# EAGLE design FalangeNANO (EAGLE 7.6.0)
CNAME: OffGrid-Devices Falange; CREVISION: B; DESIGNER: Tiago Angelo
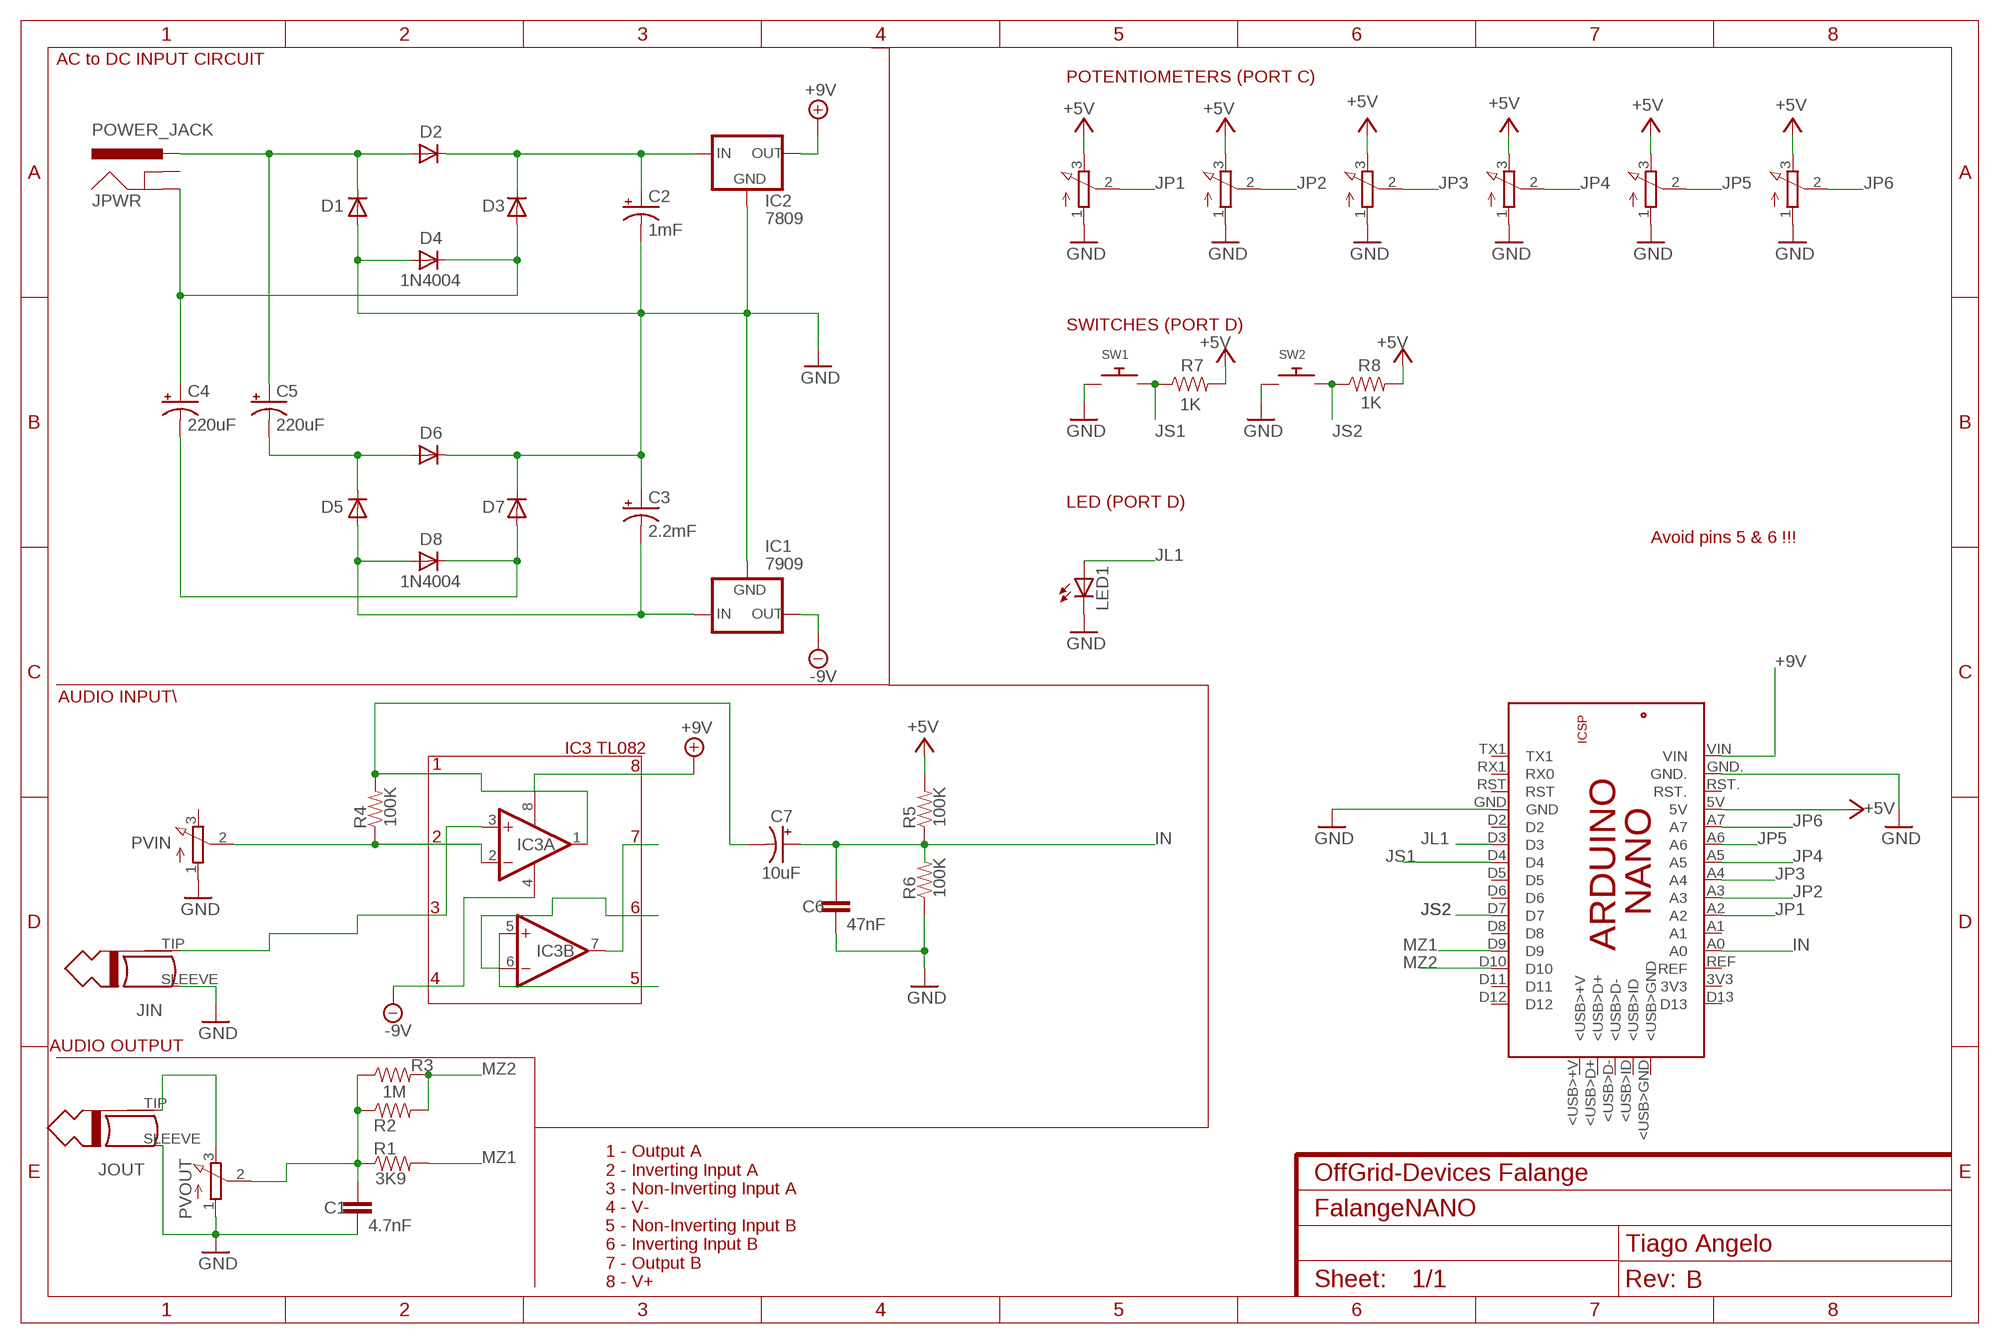
[diagram p0: schematic, sheet 1]

## Parts
C1  4.7nF  C-EU050-025X075  [C050-025X075]
C2  1mF  CPOL-USE30-16AXIAL  [E30-16]
C3  2.2mF  CPOL-USE35-16AXIAL  [E35-16]
C4  220uF  CPOL-USE5-10.5  [E5-10,5]
C5  220uF  CPOL-USE5-10.5  [E5-10,5]
C6  47nF  C-EU050-025X075  [C050-025X075]
C7  10uF  CPOL-USE2.5-6  [E2,5-6]
D1  1N4004  [DO41-10]
D2  1N4004  [DO41-10]
D3  1N4004  [DO41-10]
D4  1N4004  [DO41-10]
D5  1N4004  [DO41-10]
D6  1N4004  [DO41-10]
D7  1N4004  [DO41-10]
D8  1N4004  [DO41-10]
IC1  7909  79XXL  [79XXL]
IC2  7809  78XXL  [78XXL]
IC3  TL082P  [DIL08]
JIN  MONO_PLUG  [TWO_PADS]
JOUT  MONO_PLUG  [TWO_PADS]
JPWR  POWER_JACK  [POWER_JACK_PTH]
LED1  LED3MM  [LED3MM]
P1  3RP/1610N  [3RP/1610N]
P2  3RP/1610N  [3RP/1610N]
P3  3RP/1610N  [3RP/1610N]
P4  3RP/1610N  [3RP/1610N]
P5  3RP/1610N  [3RP/1610N]
P6  3RP/1610N  [3RP/1610N]
PCB1  ARDUINO_NANO  [ARDUINO_NANO]
PVIN  3RP/1610N  [3RP/1610N]
PVOUT  3RP/1610N  [3RP/1610N]
R1  3K9  1KOHM-HORIZ-1/4W-5%  [AXIAL-0.3]
R2  1M  1KOHM-HORIZ-1/4W-5%  [AXIAL-0.3]
R3  1M  1KOHM-HORIZ-1/4W-5%  [AXIAL-0.3]
R4  100K  1KOHM-HORIZ-1/4W-5%  [AXIAL-0.3]
R5  100K  1KOHM-HORIZ-1/4W-5%  [AXIAL-0.3]
R6  100K  1KOHM-HORIZ-1/4W-5%  [AXIAL-0.3]
R7  1K  1KOHM-HORIZ-1/4W-5%  [AXIAL-0.3]
R8  1K  1KOHM-HORIZ-1/4W-5%  [AXIAL-0.3]
SW1  SWITCH_PUSHBUTTONEVQ-PE  [TACT_PANA-EVQ]
SW2  SWITCH_PUSHBUTTONEVQ-PE  [TACT_PANA-EVQ]

## Nets
+5V: P1.3(E) P2.3(E) P3.3(E) P4.3(E) P5.3(E) P6.3(E) PCB1.5V R5.P$2 R7.P$2 R8.P$2
+9V: IC2.OUT IC3.8(P:V+) PCB1.VIN
-9V: IC1.OUT IC3.4(P:V-)
GND: C1.2 C2.- C3.+ C6.2 D1.A D4.A D6.C D7.C IC1.GND IC2.GND JIN.SLEEVE JOUT.SLEEVE LED1.K(C) P1.1(A) P2.1(A) P3.1(A) P4.1(A) P5.1(A) P6.1(A) PCB1.GND PCB1.GND. PVIN.1(A) PVOUT.1(A) R6.P$1 SW1.P$1 SW2.P$1
IN: C6.1 C7.+ PCB1.A0 R5.P$1 R6.P$2
JL1: LED1.A PCB1.D3
JP1: P1.2(S) PCB1.A2
JP2: P2.2(S) PCB1.A3
JP3: P3.2(S) PCB1.A4
JP4: P4.2(S) PCB1.A5
JP5: P5.2(S) PCB1.A6
JP6: P6.2(S) PCB1.A7
JP8-2: C1.1 PVOUT.2(S) R1.P$1 R2.P$1 R3.P$1
JP8-3: JOUT.TIP PVOUT.3(E)
JS1: PCB1.D4 R7.P$1 SW1.P$2
JS2: PCB1.D7 R8.P$1 SW2.P$2
MZ1: PCB1.D9 R1.P$2
MZ2: PCB1.D10 R2.P$2 R3.P$2
N$2: C5.- D5.C D6.A
N$4: C4.- D7.A D8.C
N$5: C2.+ D2.C D3.C IC2.IN
N$7: C3.- D5.A D8.A IC1.IN
N$8: C7.- IC3.1(A:OUT) R4.P$2
N$9: IC3.2(A:-IN) PVIN.2(S) R4.P$1
N$12: IC3.7(B:OUT)
N$13: IC3.6(B:-IN)
N$14: IC3.5(B:+IN)
N$15: IC3.3(A:+IN) JIN.TIP
PWRSLV: C4.+ D3.A D4.C JPWR.GND
PWRTIP: C5.+ D1.C D2.A JPWR.PWR
Unconnected: JPWR.GNDBREAK PCB1.3V3 PCB1.5V. PCB1.<USB>+V PCB1.<USB>D+ PCB1.<USB>D- PCB1.<USB>GND PCB1.<USB>ID PCB1.A1 PCB1.D2 PCB1.D5 PCB1.D6 PCB1.D8 PCB1.D11 PCB1.D12 PCB1.D13 PCB1.GND_ PCB1.MISO PCB1.MOSI PCB1.REF PCB1.RESET.. PCB1.RST PCB1.RST. PCB1.RX1(RX0) PCB1.SCK PCB1.TX1 PVIN.3(E)

## Notes on the sheet
- AC to DC INPUT CIRCUIT
- POTENTIOMETERS (PORT C)
- SWITCHES (PORT D)
- LED (PORT D)
- Avoid pins 5 & 6 !!!
- AUDIO INPUT\
- IC3 TL082
- 1 | 8
- 2 | 7
- 3 | 6
- 4 | 5
- AUDIO OUTPUT
- 1 - Output A
  2 - Inverting Input A
  3 - Non-Inverting Input A
  4 - V-
  5 - Non-Inverting Input B
  6 - Inverting Input B
  7 - Output B
  8 - V+

## Library data of the parts
C1 C6 = rcl:C-EU: CAPACITOR, European symbol
C2 C3 = offgrid-devices:CPOL-US: POLARIZED CAPACITOR, American symbol
C4 C5 C7 = rcl:CPOL-US: POLARIZED CAPACITOR, American symbol
D1-D8 = adafruit:1N4004: DIODE General purpose 1N400x type rectifier (With bigger pads) http://www.ladyada.net/library/pcb/eaglelibrary.html
IC1 = v-reg:79XXL: VOLTAGE REGULATOR
IC2 = v-reg:78XXL: VOLTAGE REGULATOR
IC3 = linear:TL082: OP AMP Data sheet <http://www.ti.com/lit/ds/symlink/tl084a . pdf>; DATA_SHEET: <a href="http://www.ti.com/lit/ds/symlink/tl084a.pdf"> Data sheet </a>
JIN JOUT = gm-jacks:MONO_PLUG
JPWR = SparkFun-Connectors:POWER_JACK: Power Jack Connector This is the standard 5.5mm barrel jack for power. The PTH is the most common, proven, reliable, footprint. The Slot footprint only works if the mill layer is transmitted to the PCB fab house so be warned. Here are the connectors we sell at SparkFun: DC Barrel Power Jack/Connector <https://www.sparkfun.com/products/119> (PRT-00119) DC Barrel Power Jack/Connector (SMD) <https://www.sparkfun.com/products/12748> (PRT-12748) DC Barrel Jack Adapter - Breadboard Compatible <https://www.sparkfun.com/products/10811> (PRT-10811) It is used on this SparkFun product (and many, many others): SparkFun RedBoard - Programmed with Arduino <https://www.sparkfun.com/products/12757> (DEV-12757) Also, if you need a mating power supply or connector, please check these out: Wall Adapter Power Supply - 9VDC 650mA <https://www.sparkfun.com/products/298> (TOL-00298) DC Barrel Jack Adapter - Male <https://www.sparkfun.com/products/10287> (PRT-10287); PROD_ID: CONN-08197
LED1 = led:LED: LED OSRAM: - CHIPLED LG R971, LG N971, LY N971, LG Q971, LY Q971, LO R971, LY R971 LH N974, LH R974 LS Q976, LO Q976, LY Q976 LO Q996 - Hyper CHIPLED LW Q18S LB Q993, LB Q99A, LB R99A - SideLED LS A670, LO A670, LY A670, LG A670, LP A670 LB A673, LV A673, LT A673, LW A673 LH A674 LY A675 LS A676, LA A676, LO A676, LY A676, LW A676 LS A679, LY A679, LG A679 - Hyper Micro SIDELED® LS Y876, LA Y876, LO Y876, LY Y876 LT Y87S - SmartLED LW L88C, LW L88S LB L89C, LB L89S, LG L890 LS L89K, LO L89K, LY L89K LS L896, LA L896, LO L896, LY L896 - TOPLED LS T670, LO T670, LY T670, LG T670, LP T670 LSG T670, LSP T670, LSY T670, LOP T670, LYG T670 LG T671, LOG T671, LSG T671 LB T673, LV T673, LT T673, LW T673 LH T674 LS T676, LA T676, LO T676, LY T676, LB T676, LH T676, LSB T676, LW T676 LB T67C, LV T67C, LT T67C, LS T67K, LO T67K, LY T67K, LW E67C LS E67B, LA E67B, LO E67B, LY E67B, LB E67C, LV E67C, LT E67C LW T67C LS T679, LY T679, LG T679 LS T770, LO T770, LY T770, LG T770, LP T770 LB T773, LV T773, LT T773, LW T773 LH T774 LS E675, LA E675, LY E675, LS T675 LS T776, LA T776, LO T776, LY T776, LB T776 LHGB T686 LT T68C, LB T68C - Hyper Mini TOPLED® LB M676 - Mini TOPLED Santana® LG M470 LS M47K, LO M47K, LY M47K Source: http://www.osram.convergy.de LUXEON: - LUMILED® LXK2-PW12-R00, LXK2-PW12-S00, LXK2-PW14-U00, LXK2-PW14-V00 LXK2-PM12-R00, LXK2-PM12-S00, LXK2-PM14-U00 LXK2-PE12-Q00, LXK2-PE12-R00, LXK2-PE12-S00, LXK2-PE14-T00, LXK2-PE14-U00 LXK2-PB12-K00, LXK2-PB12-L00, LXK2-PB12-M00, LXK2-PB14-N00, LXK2-PB14-P00, LXK2-PB14-Q00 LXK2-PR12-L00, LXK2-PR12-M00, LXK2-PR14-Q00, LXK2-PR14-R00 LXK2-PD12-Q00, LXK2-PD12-R00, LXK2-PD12-S00 LXK2-PH12-R00, LXK2-PH12-S00 LXK2-PL12-P00, LXK2-PL12-Q00, LXK2-PL12-R00 Source: www.luxeon.com KINGBRIGHT: KA-3528ASYC Source: www.kingbright.com
P1-P6 PVIN PVOUT = pot:3RP/1610N: 16mm Potentiometer one level Source: http://www.alphapotentiometers.net/html/16mm_pot_2.html
PCB1 = E14_Arduino_revC:ARDUINO_NANO: Device for representing an Arduino Nano board with a footprint in an EAGLE design. Created by Dave Young for Element14. More EAGLE documentation at: http://www.element14.com/community/community/knode/cadsoft_eagle
R1-R8 = SparkFun-Resistors:1KOHM: 1kΩ resistor A resistor is a passive two-terminal electrical component that implements electrical resistance as a circuit element. Resistors act to reduce current flow, and, at the same time, act to lower voltage levels within circuits. - Wikipedia; PROD_ID: RES-08380; VALUE: 1k
SW1 SW2 = adafruit:SWITCH_PUSHBUTTON: Buttons SOFTTOUCHSMD_SJ - Soft touch temporary push button (Super Junk Akihabara) Compatible with SKPMANE010 [Mouser: 688-SKPMAN] C&K_KSS = Digikey: KSS221GLFS

## Net classes
0 default: width 0.508 mm, drill 0.508 mm, clearance 0.406 mm

## Board
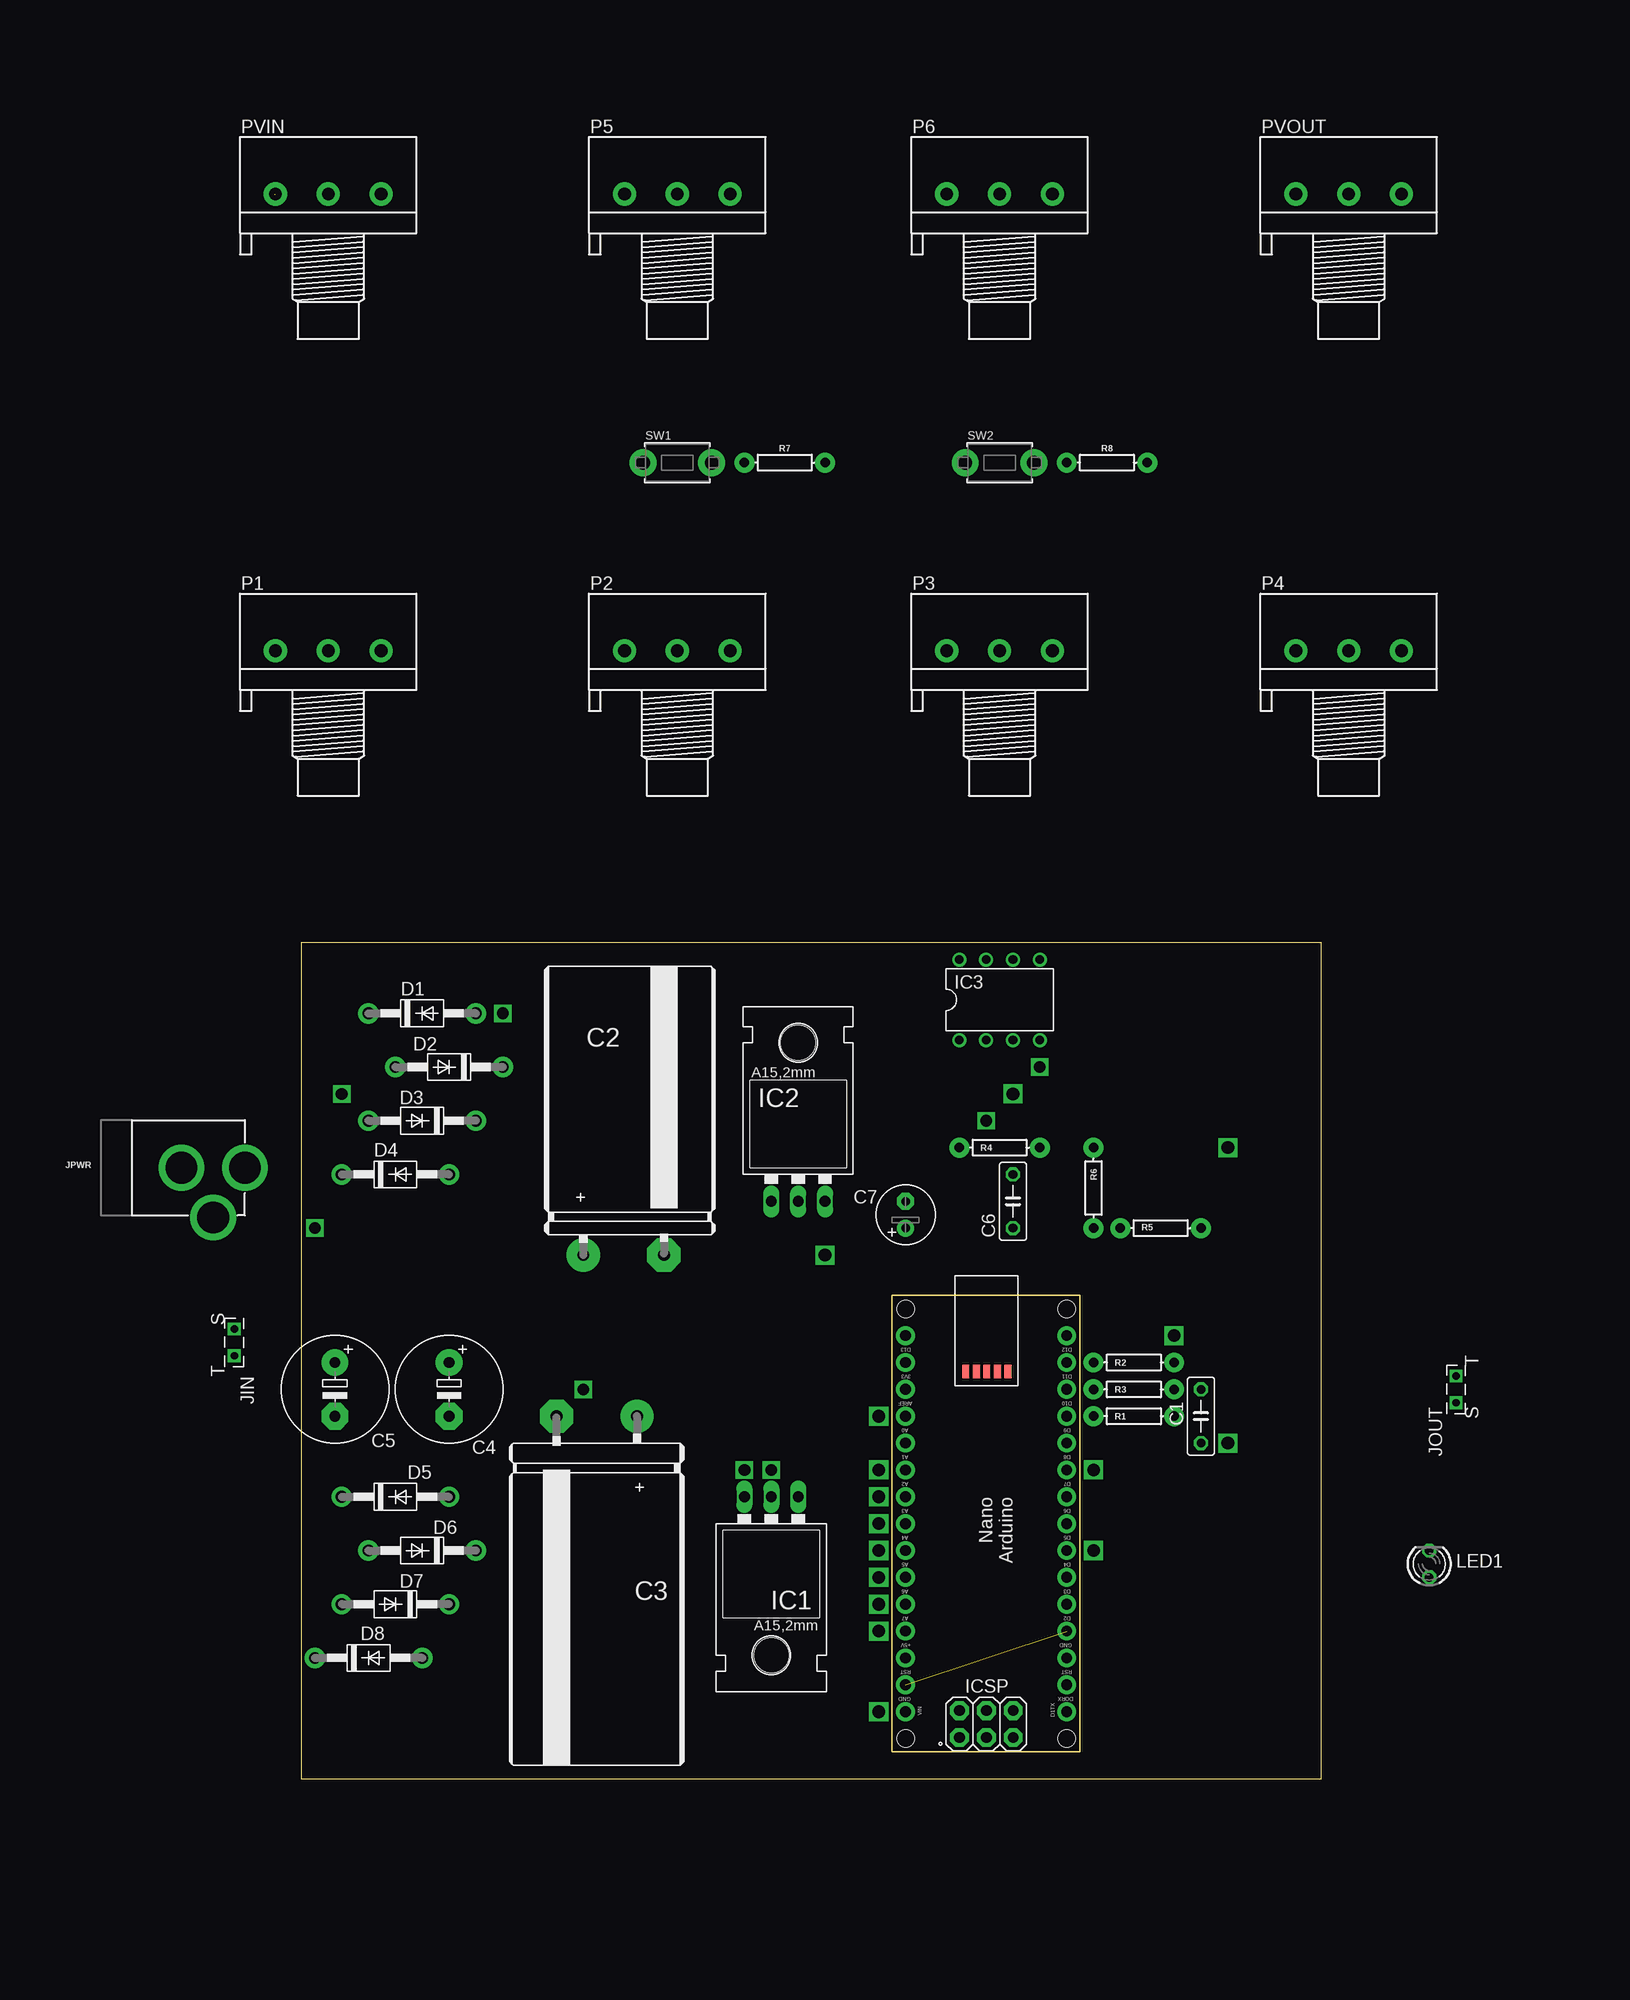
[diagram p1: board, top side]
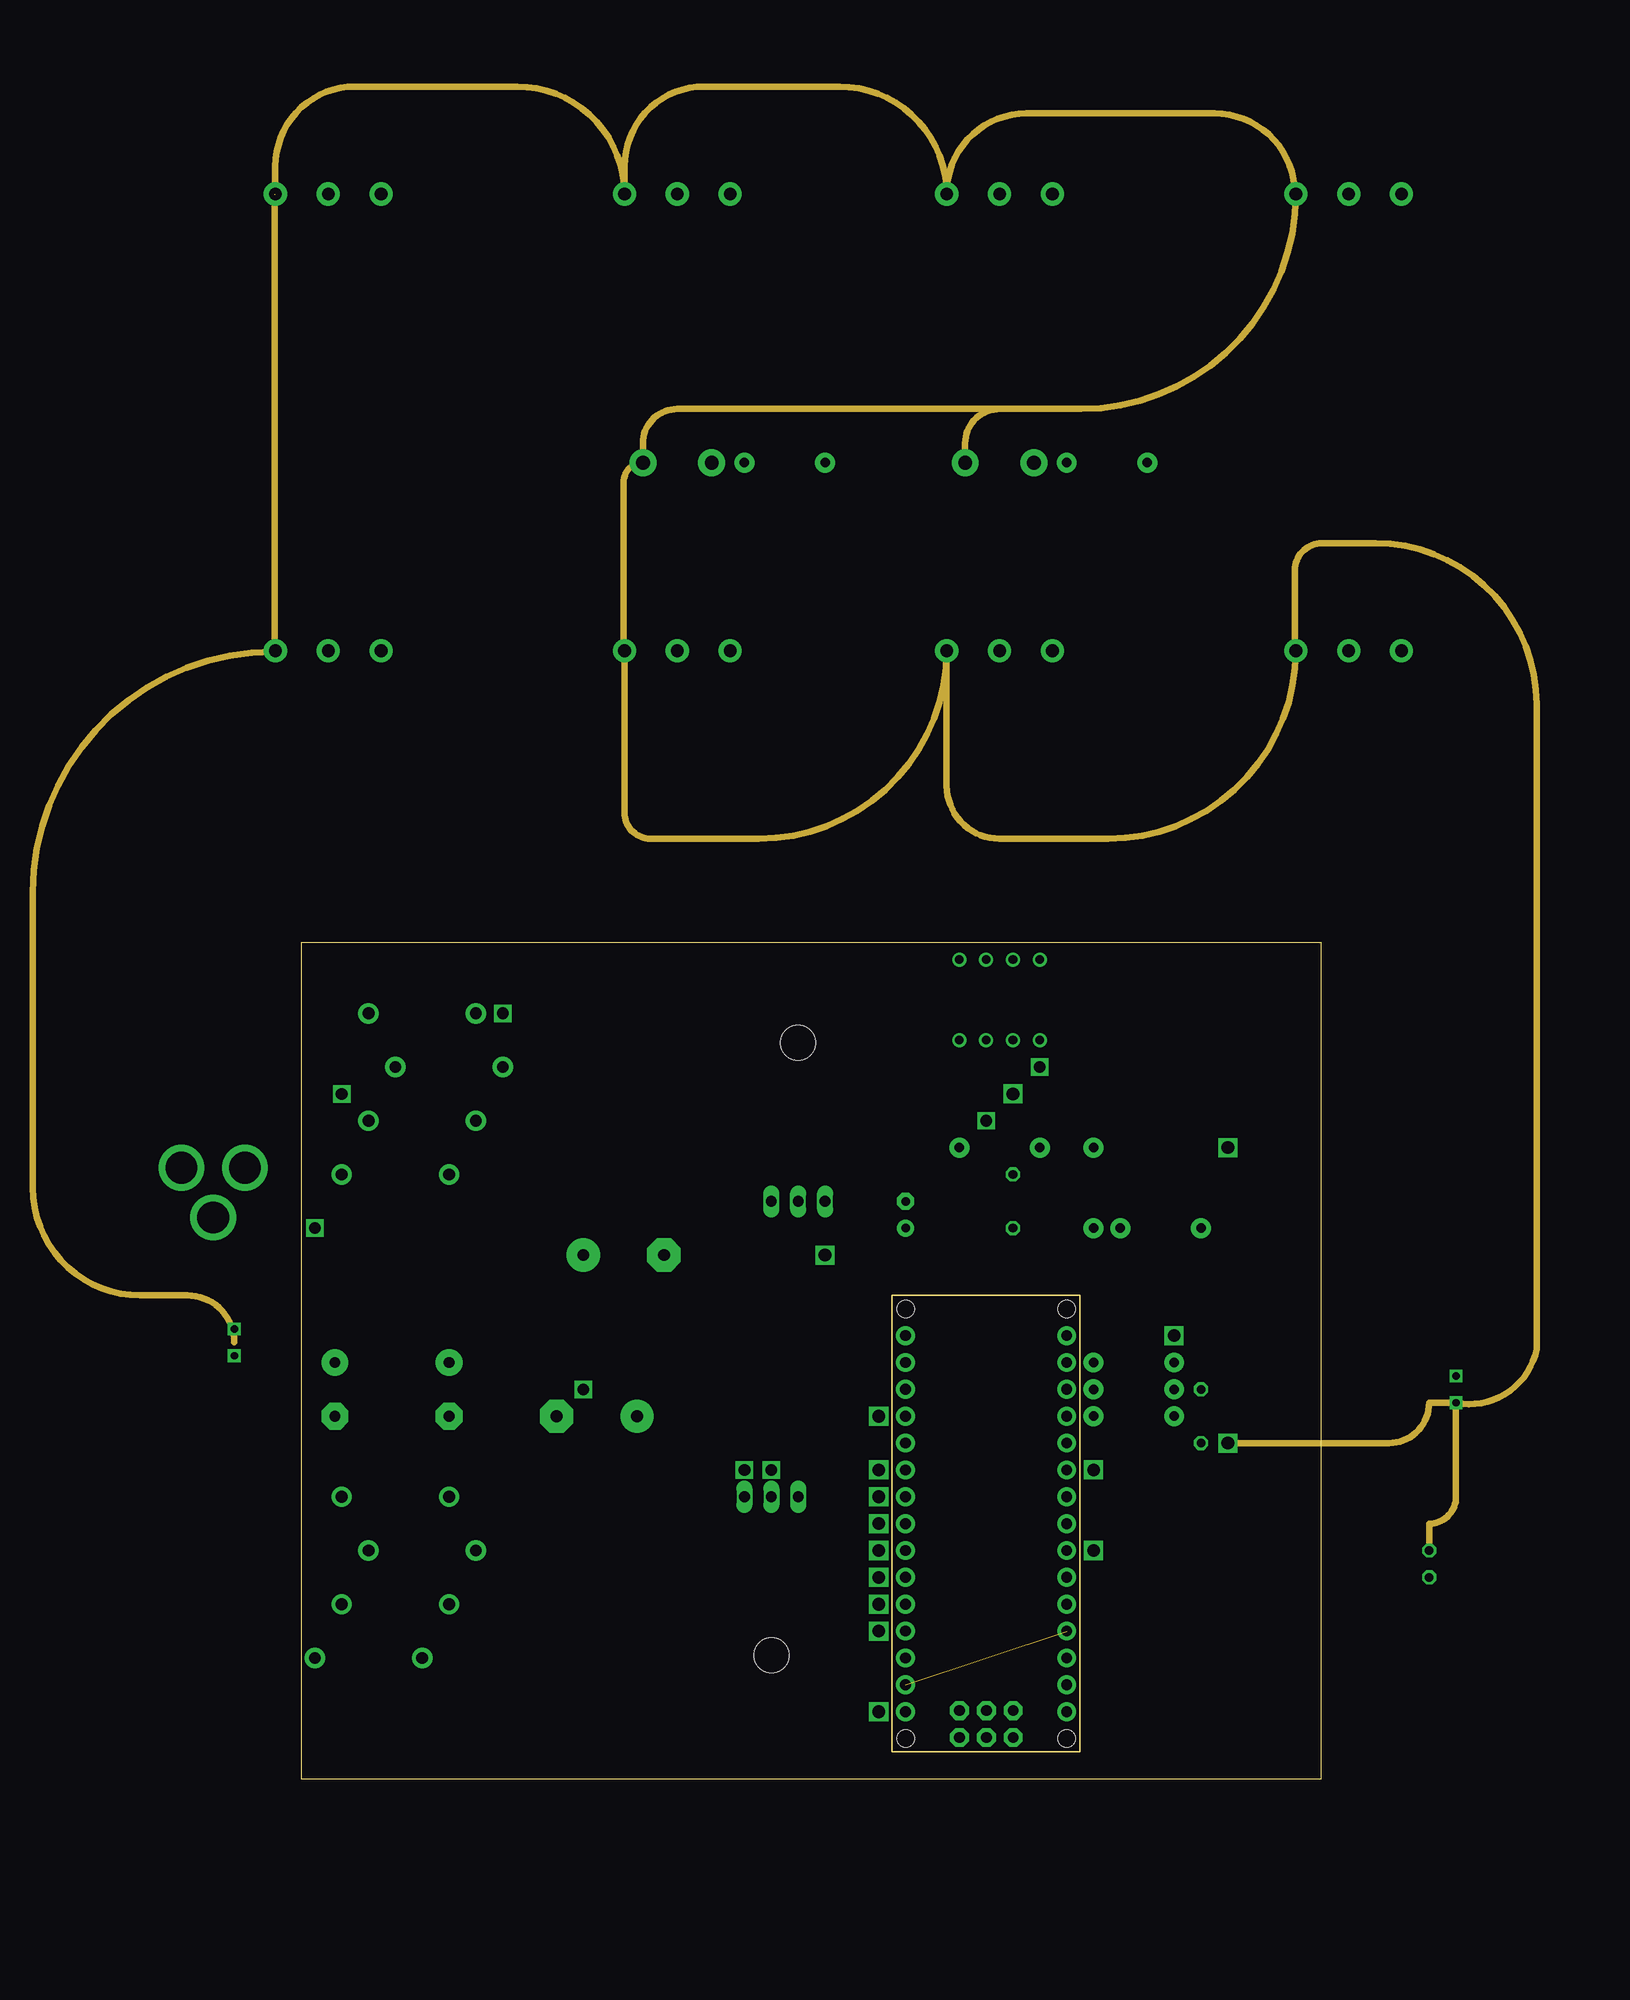
[diagram p2: board, inner layer Ground]
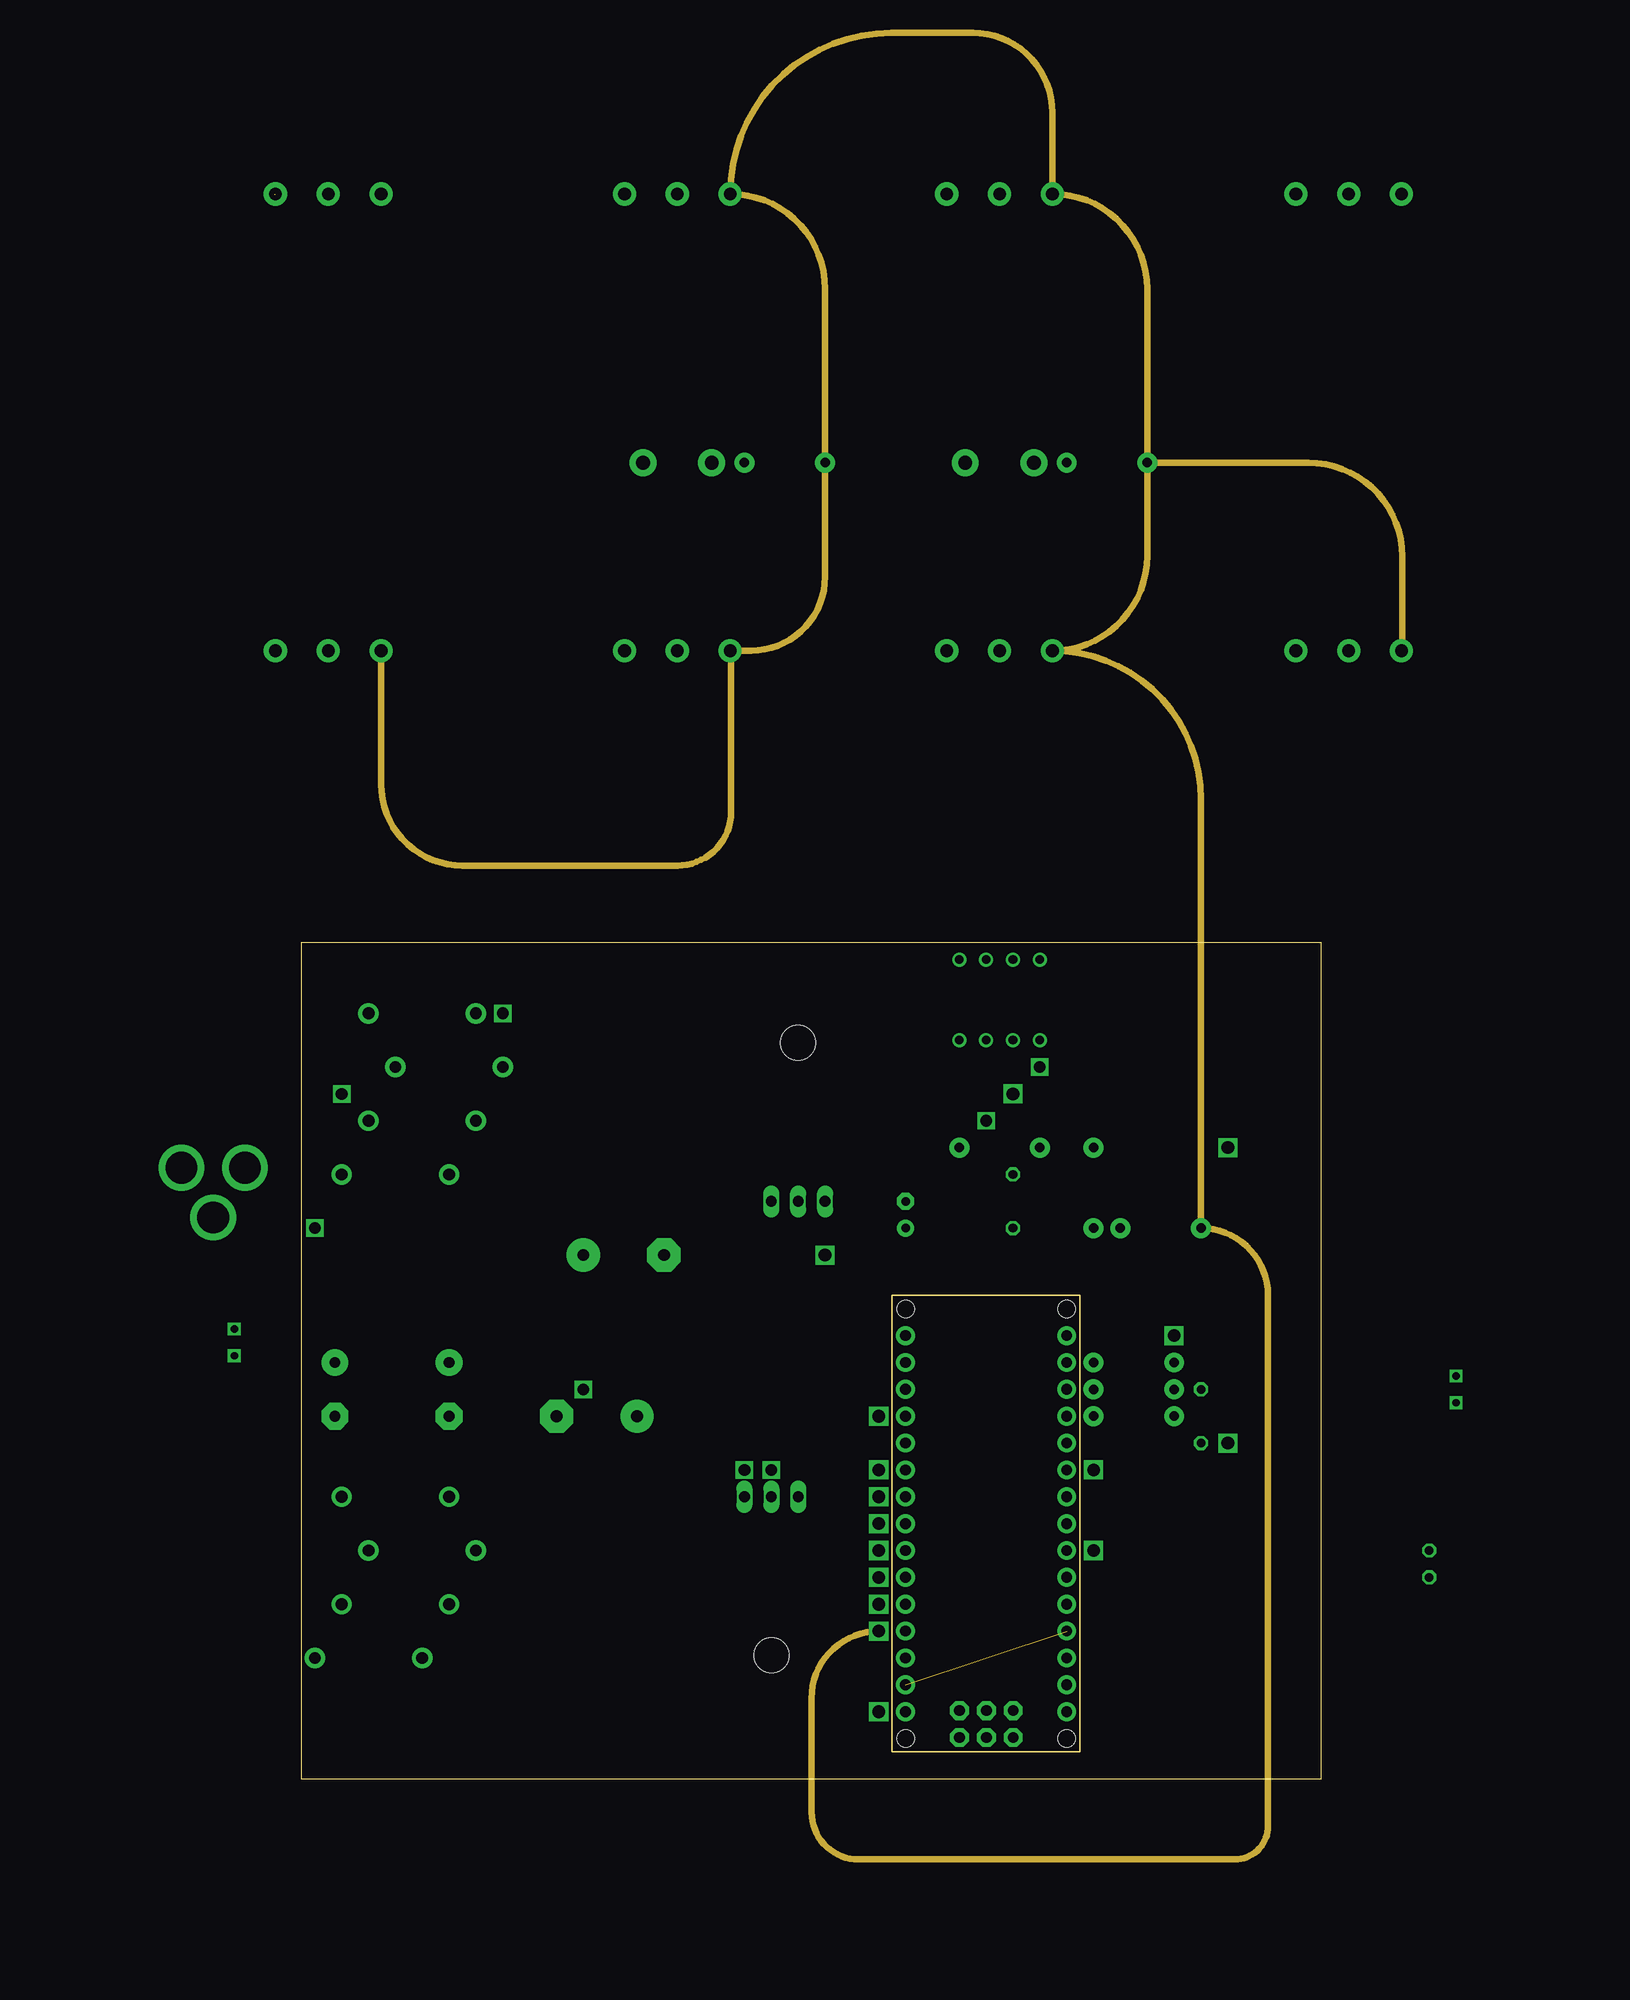
[diagram p3: board, inner layer 5V]
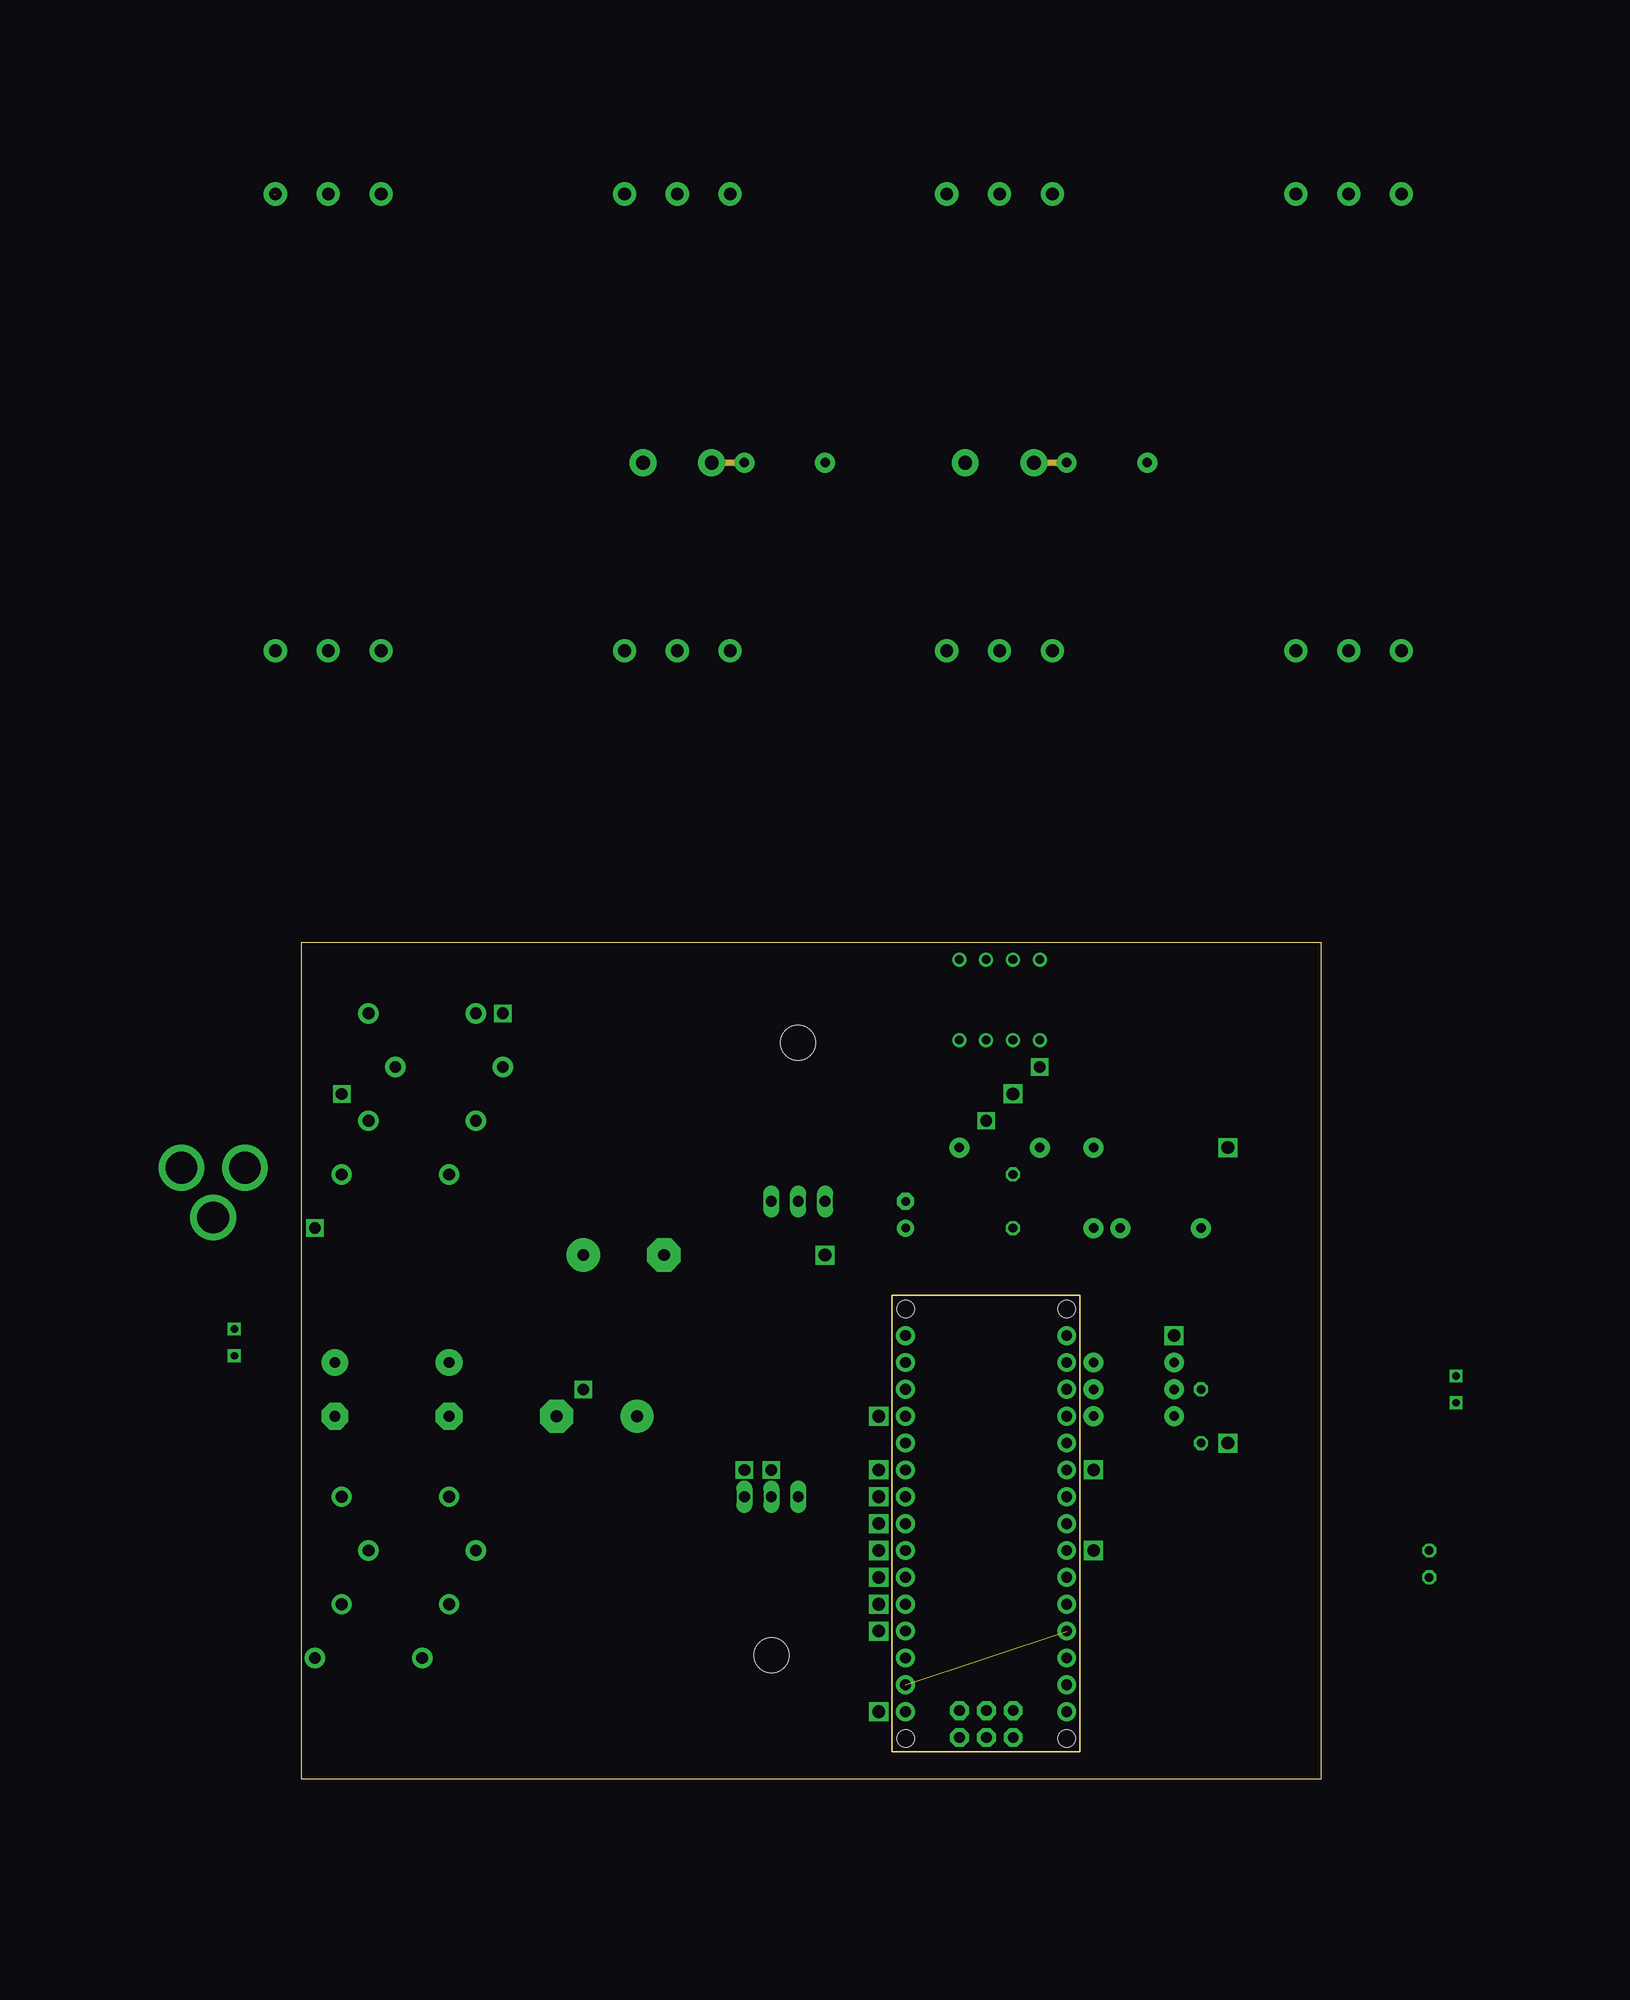
[diagram p4: board, inner layer Component2Component]
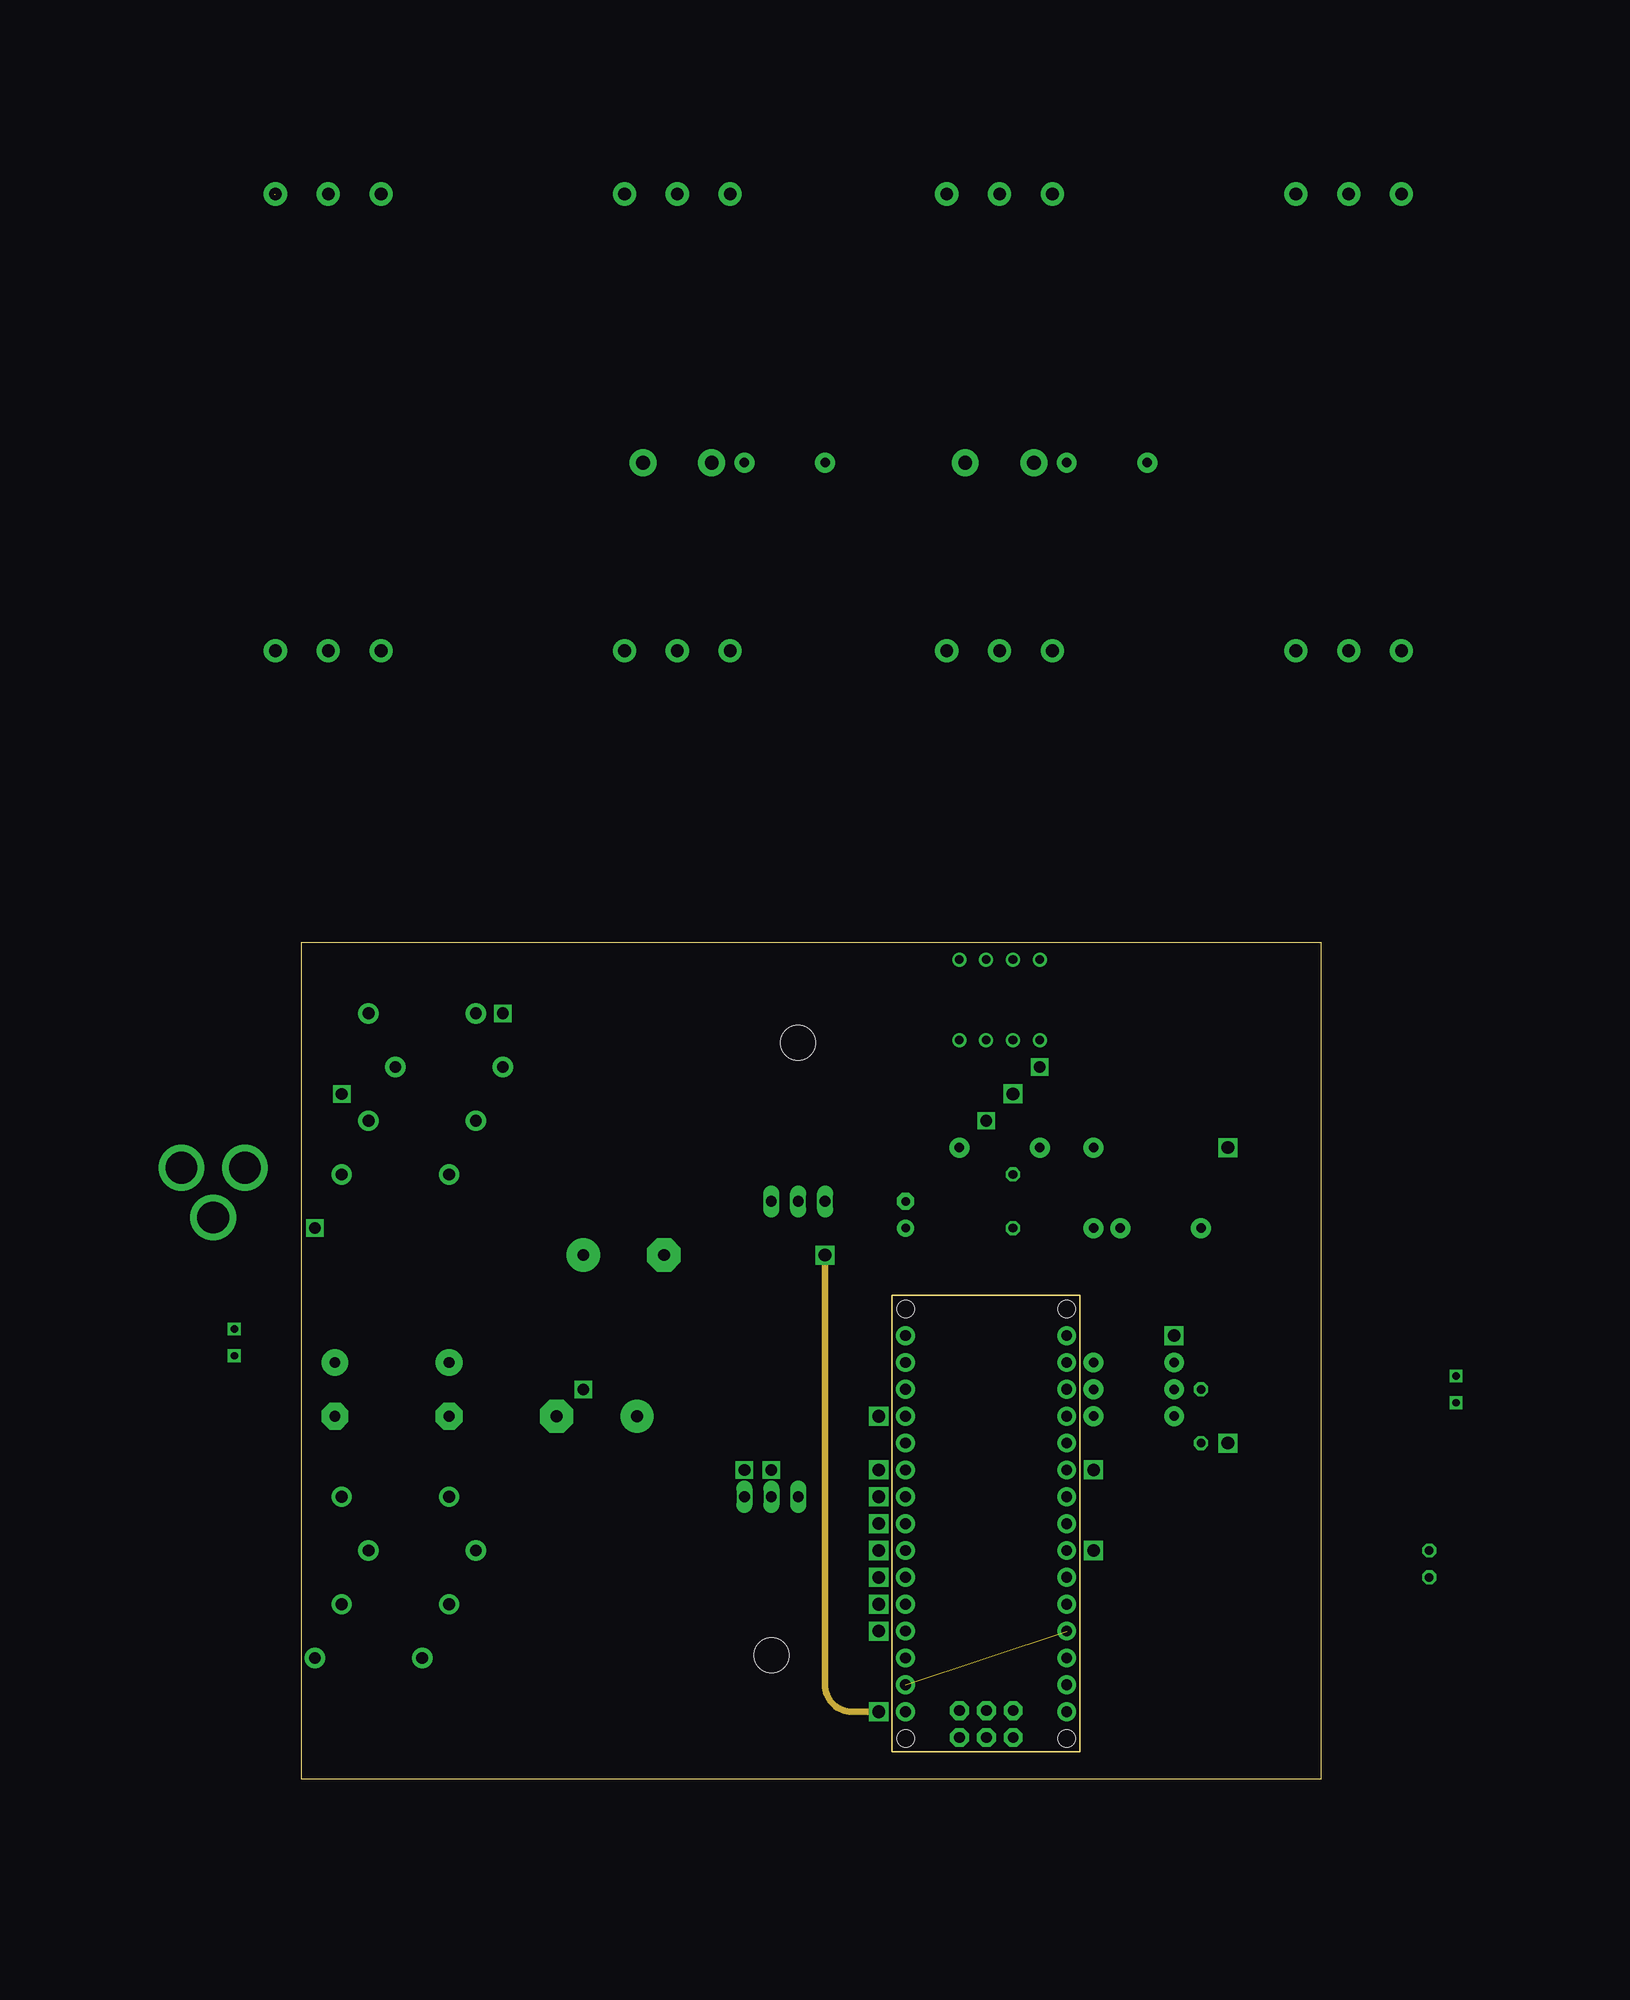
[diagram p5: board, inner layer +9V]
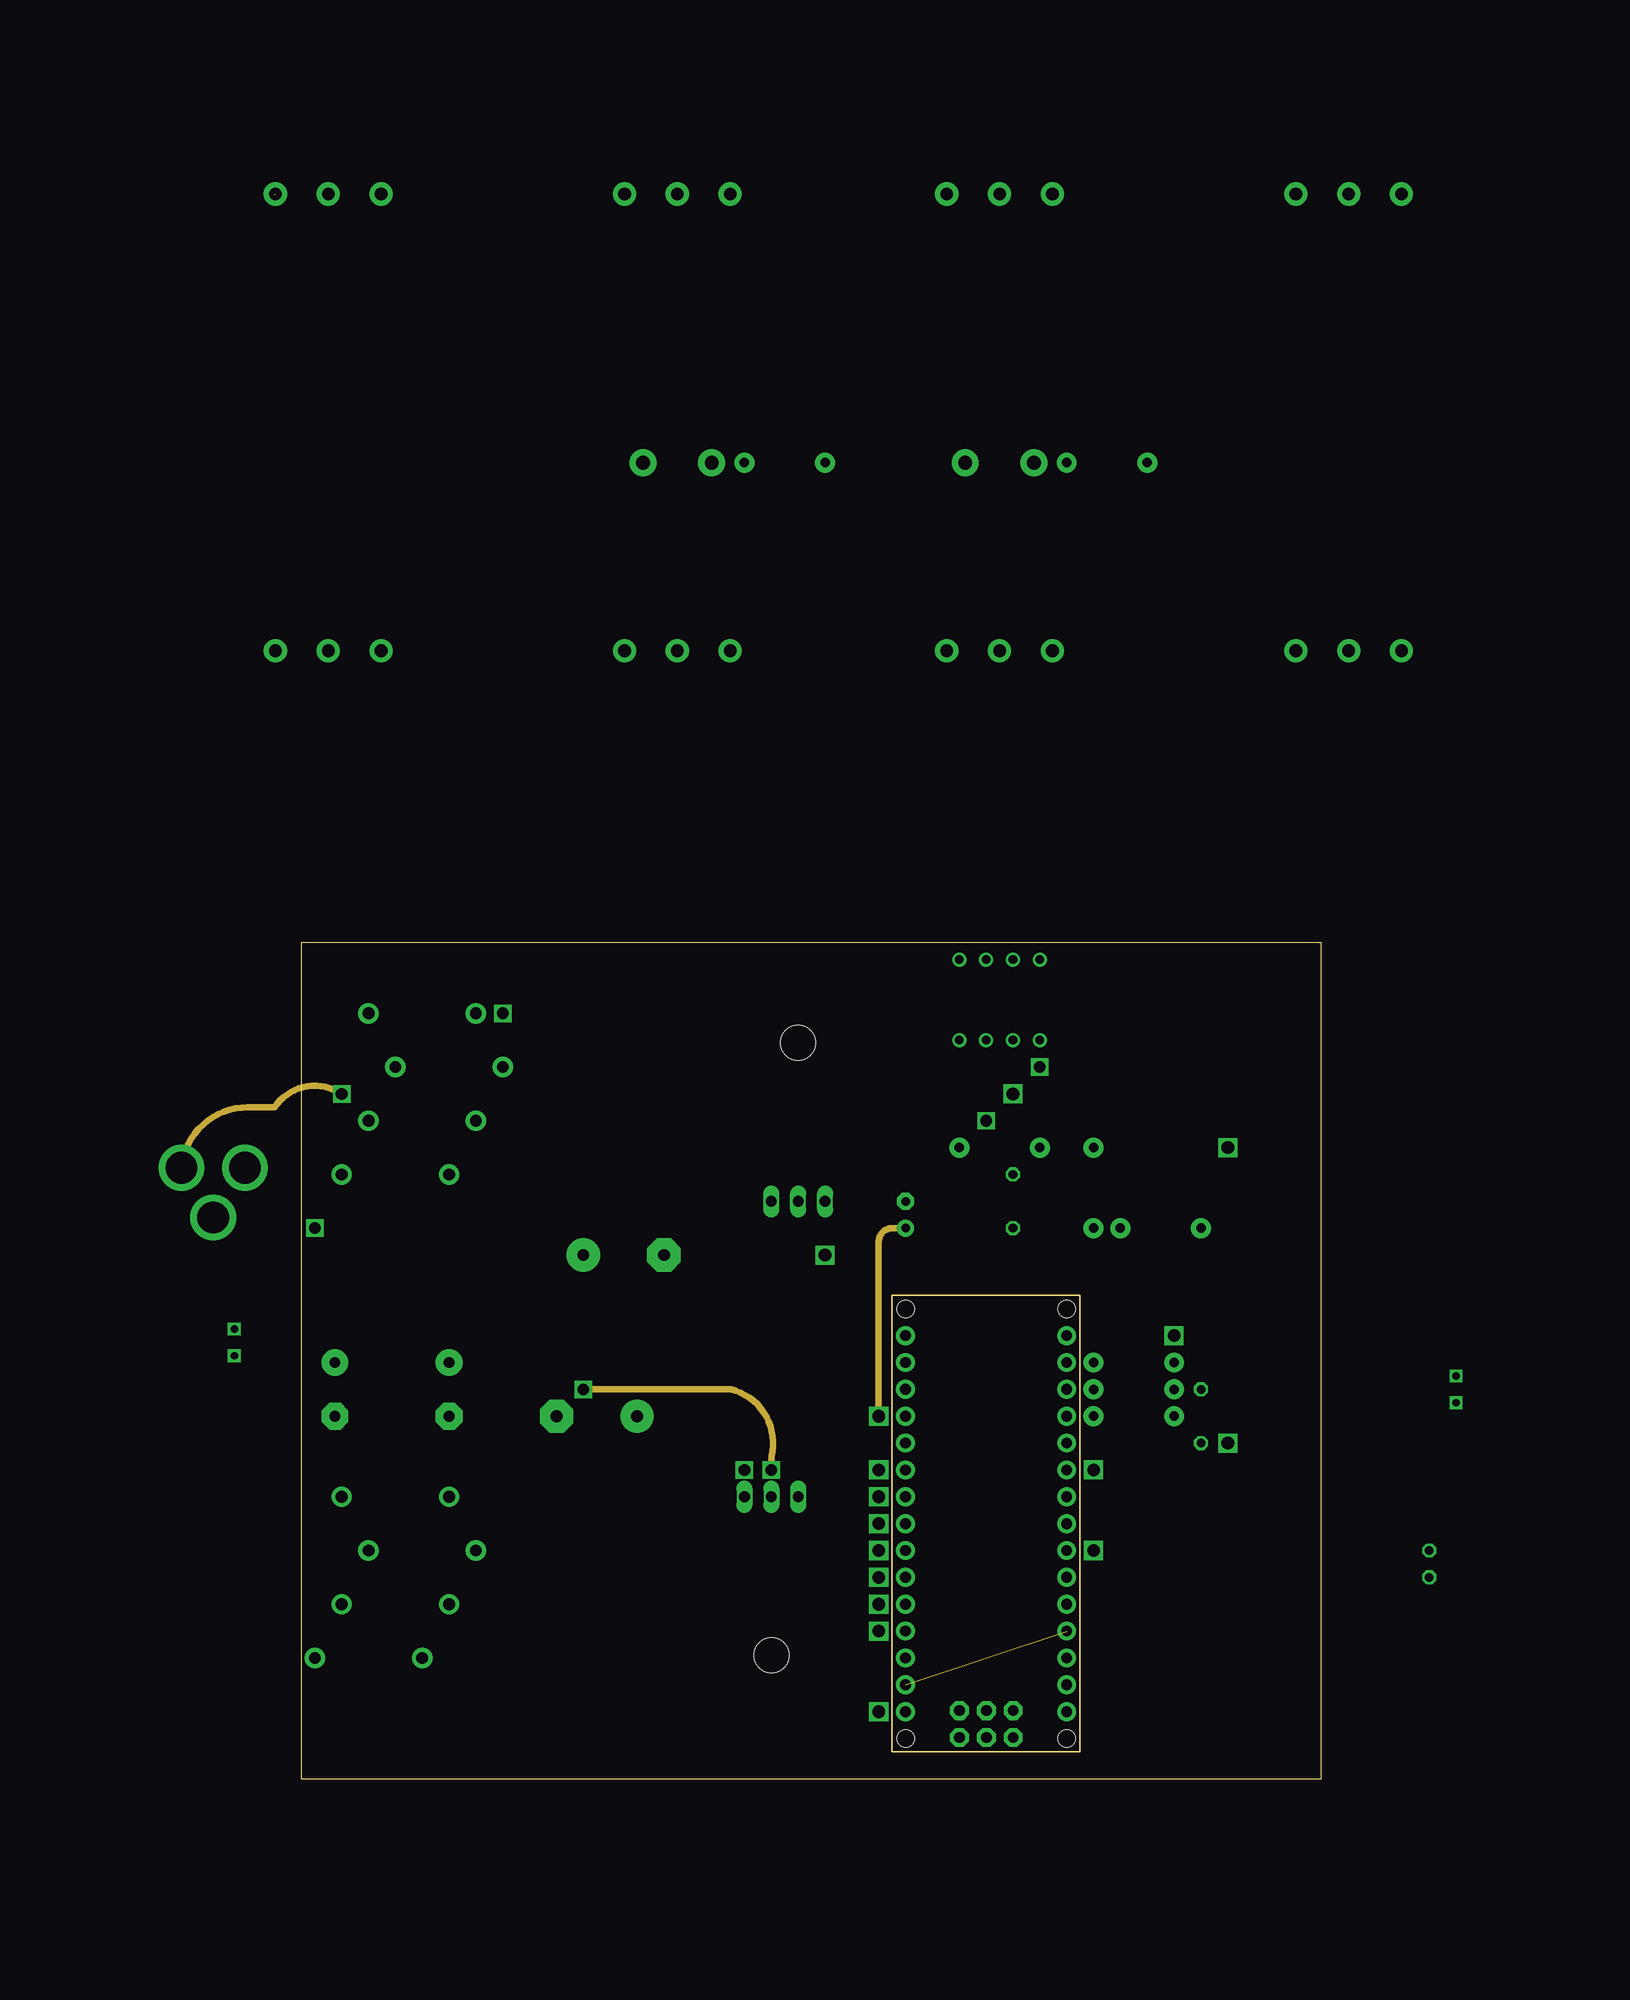
[diagram p6: board, inner layer OnBoardWire1]
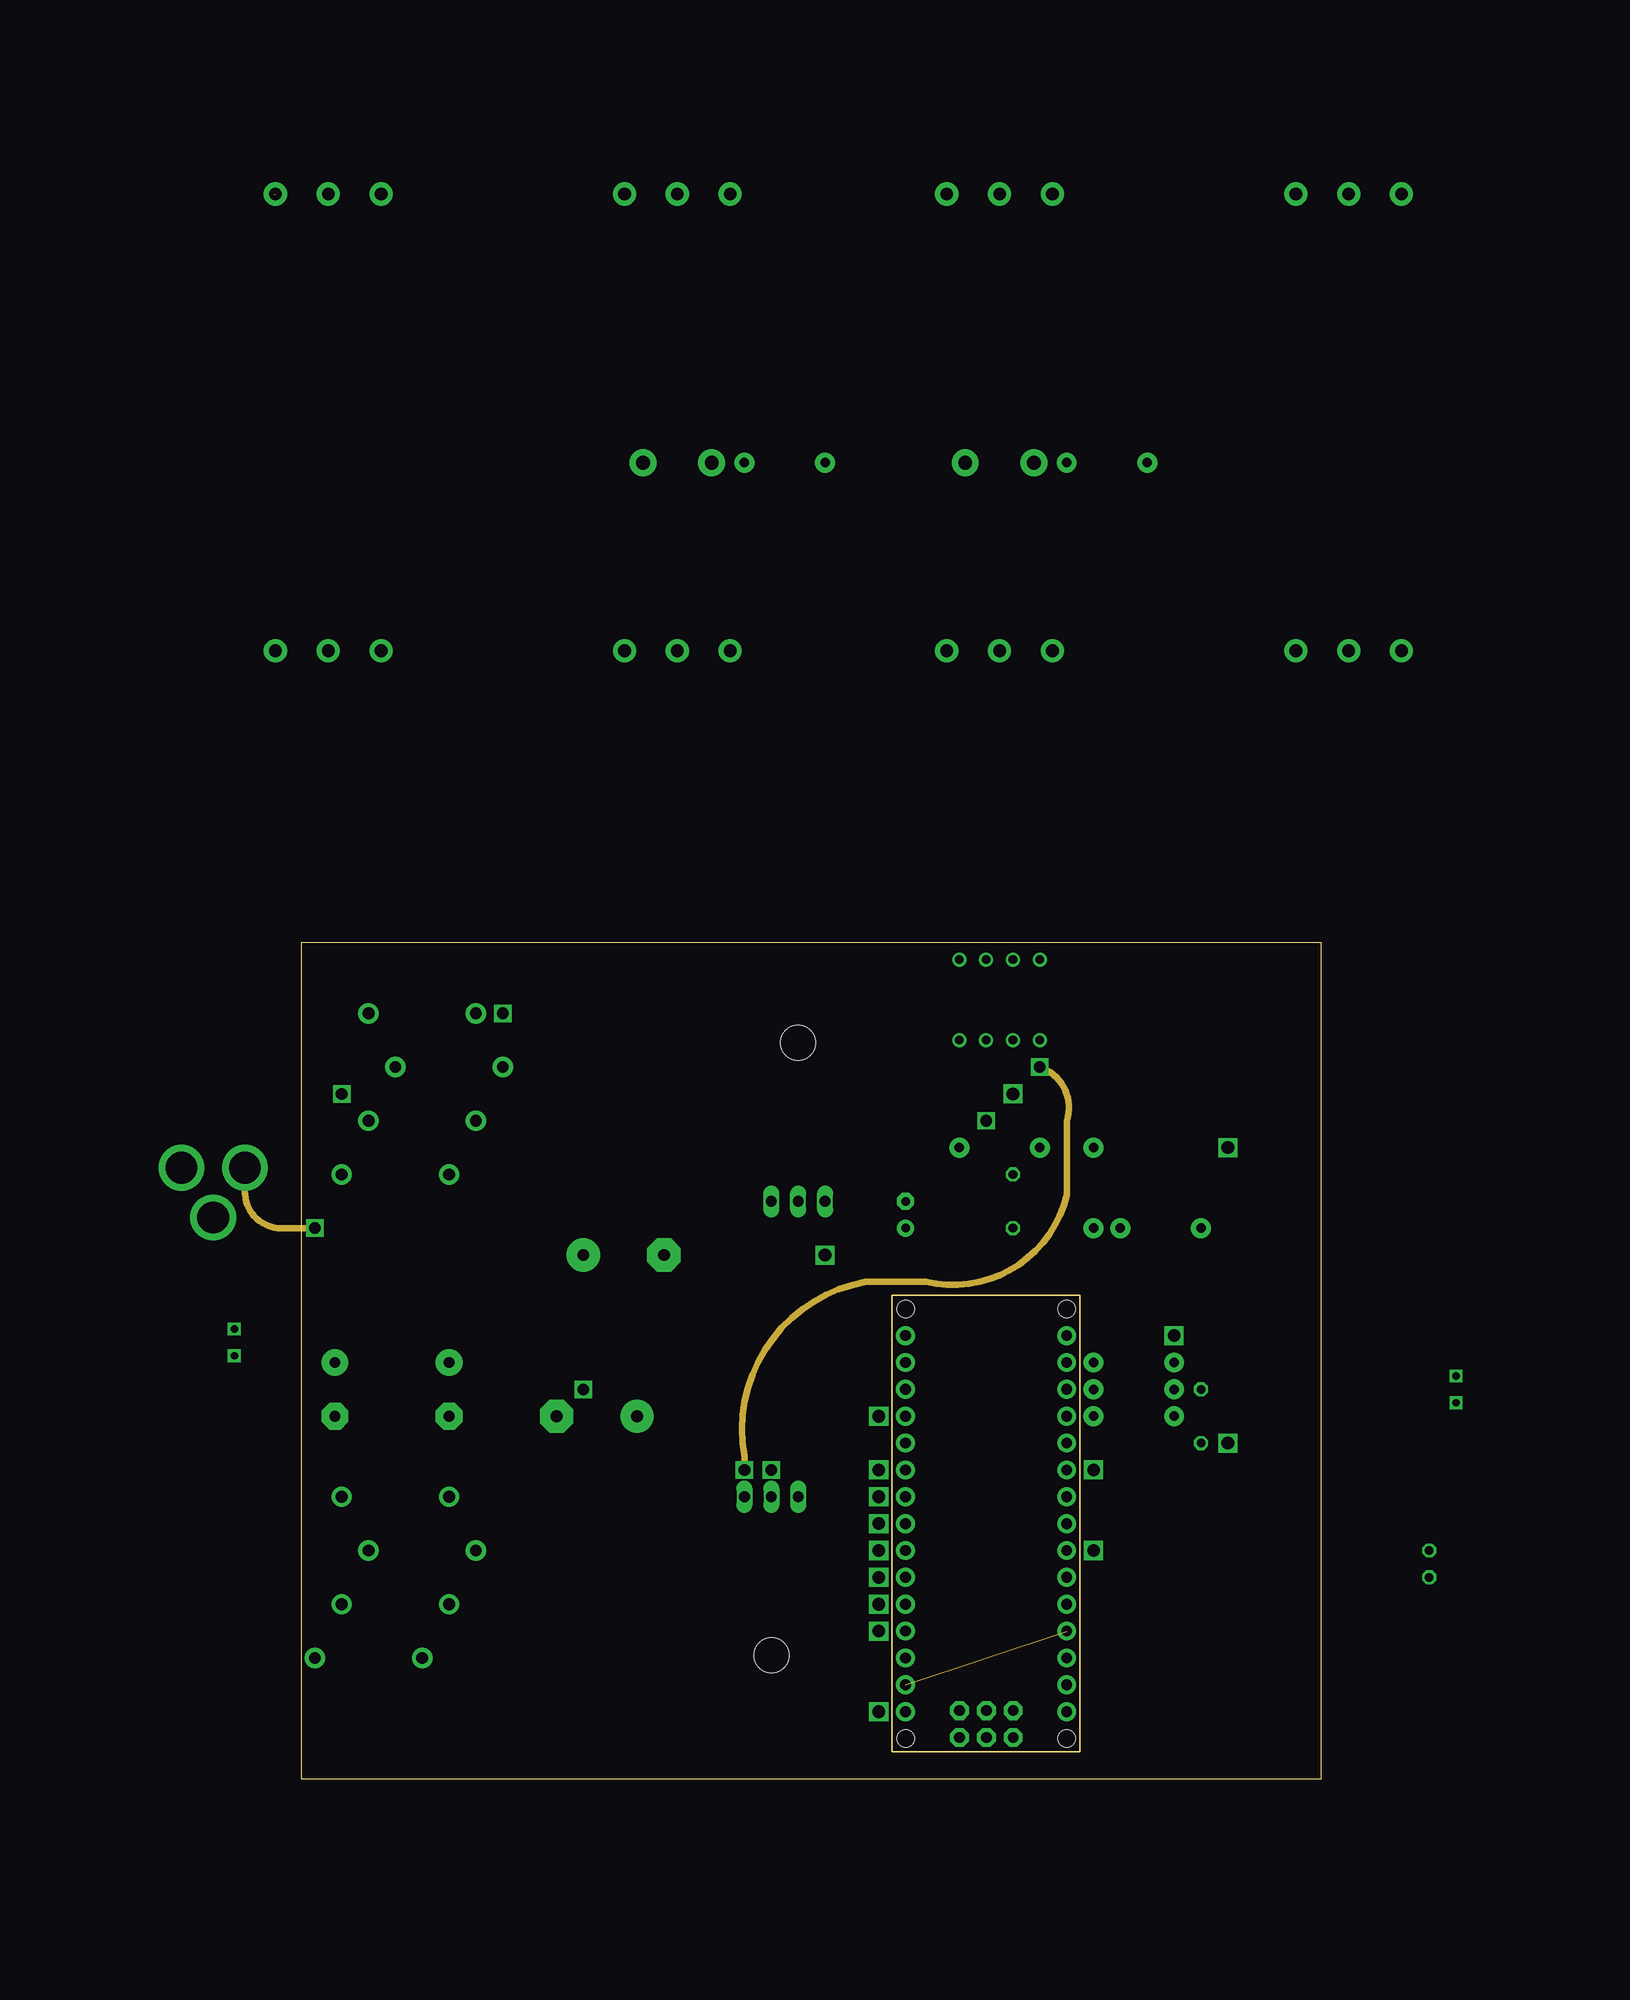
[diagram p7: board, inner layer OnBoardWire2]
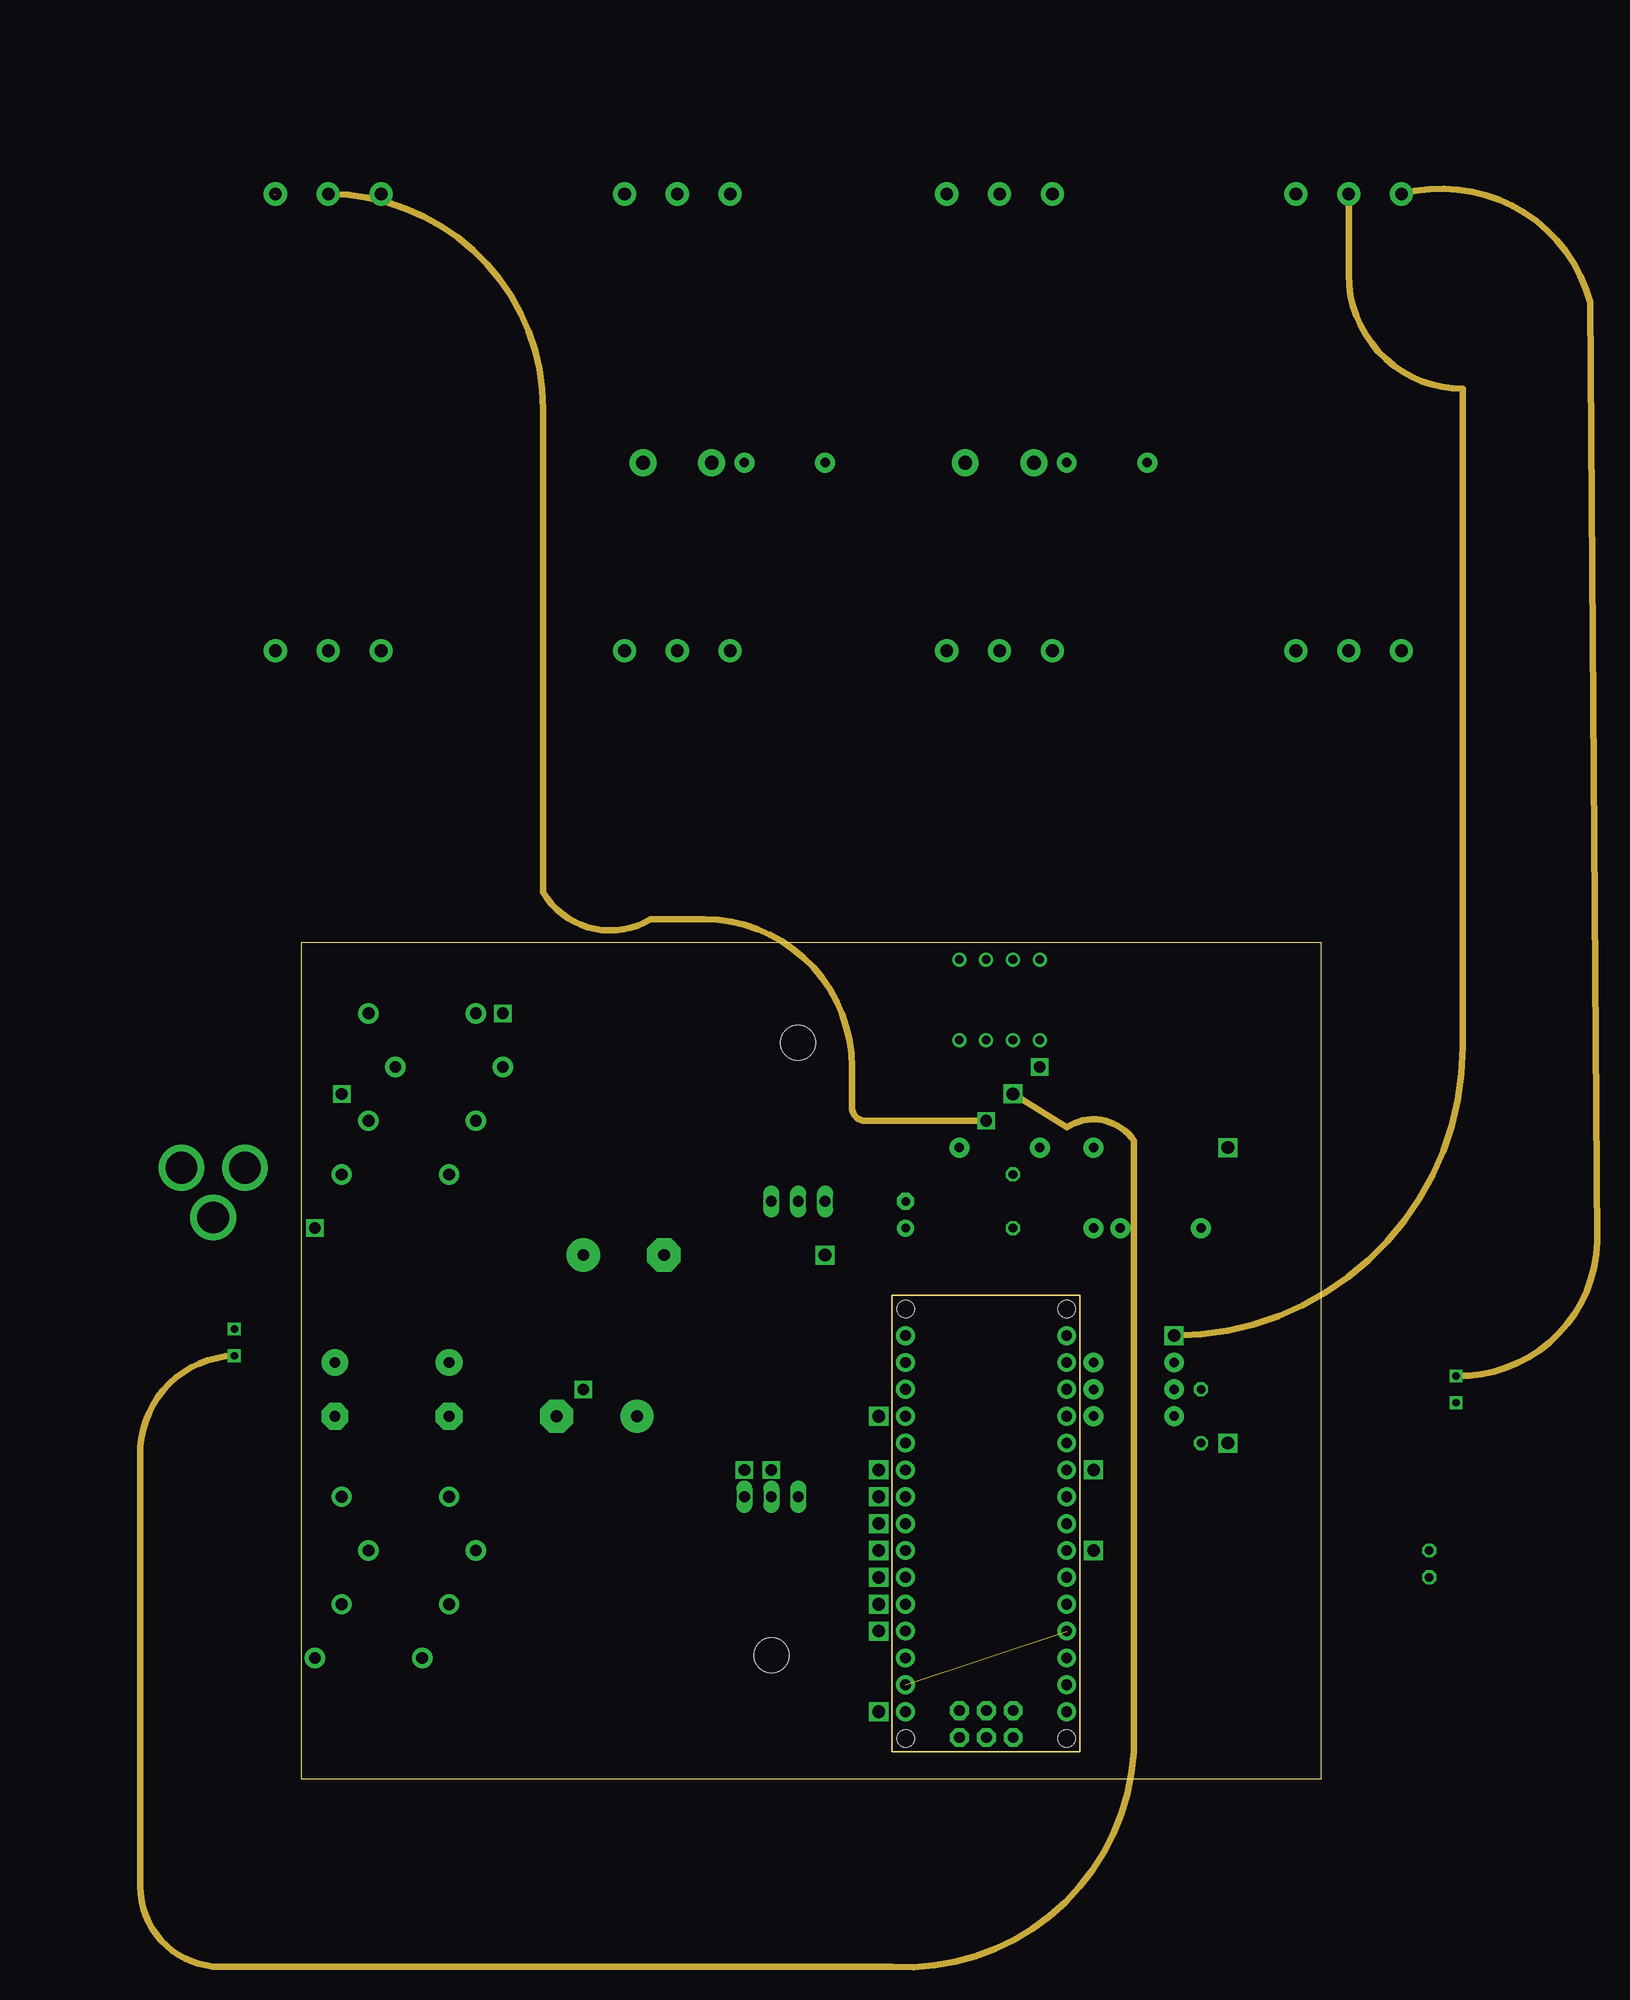
[diagram p8: board, inner layer Audio]
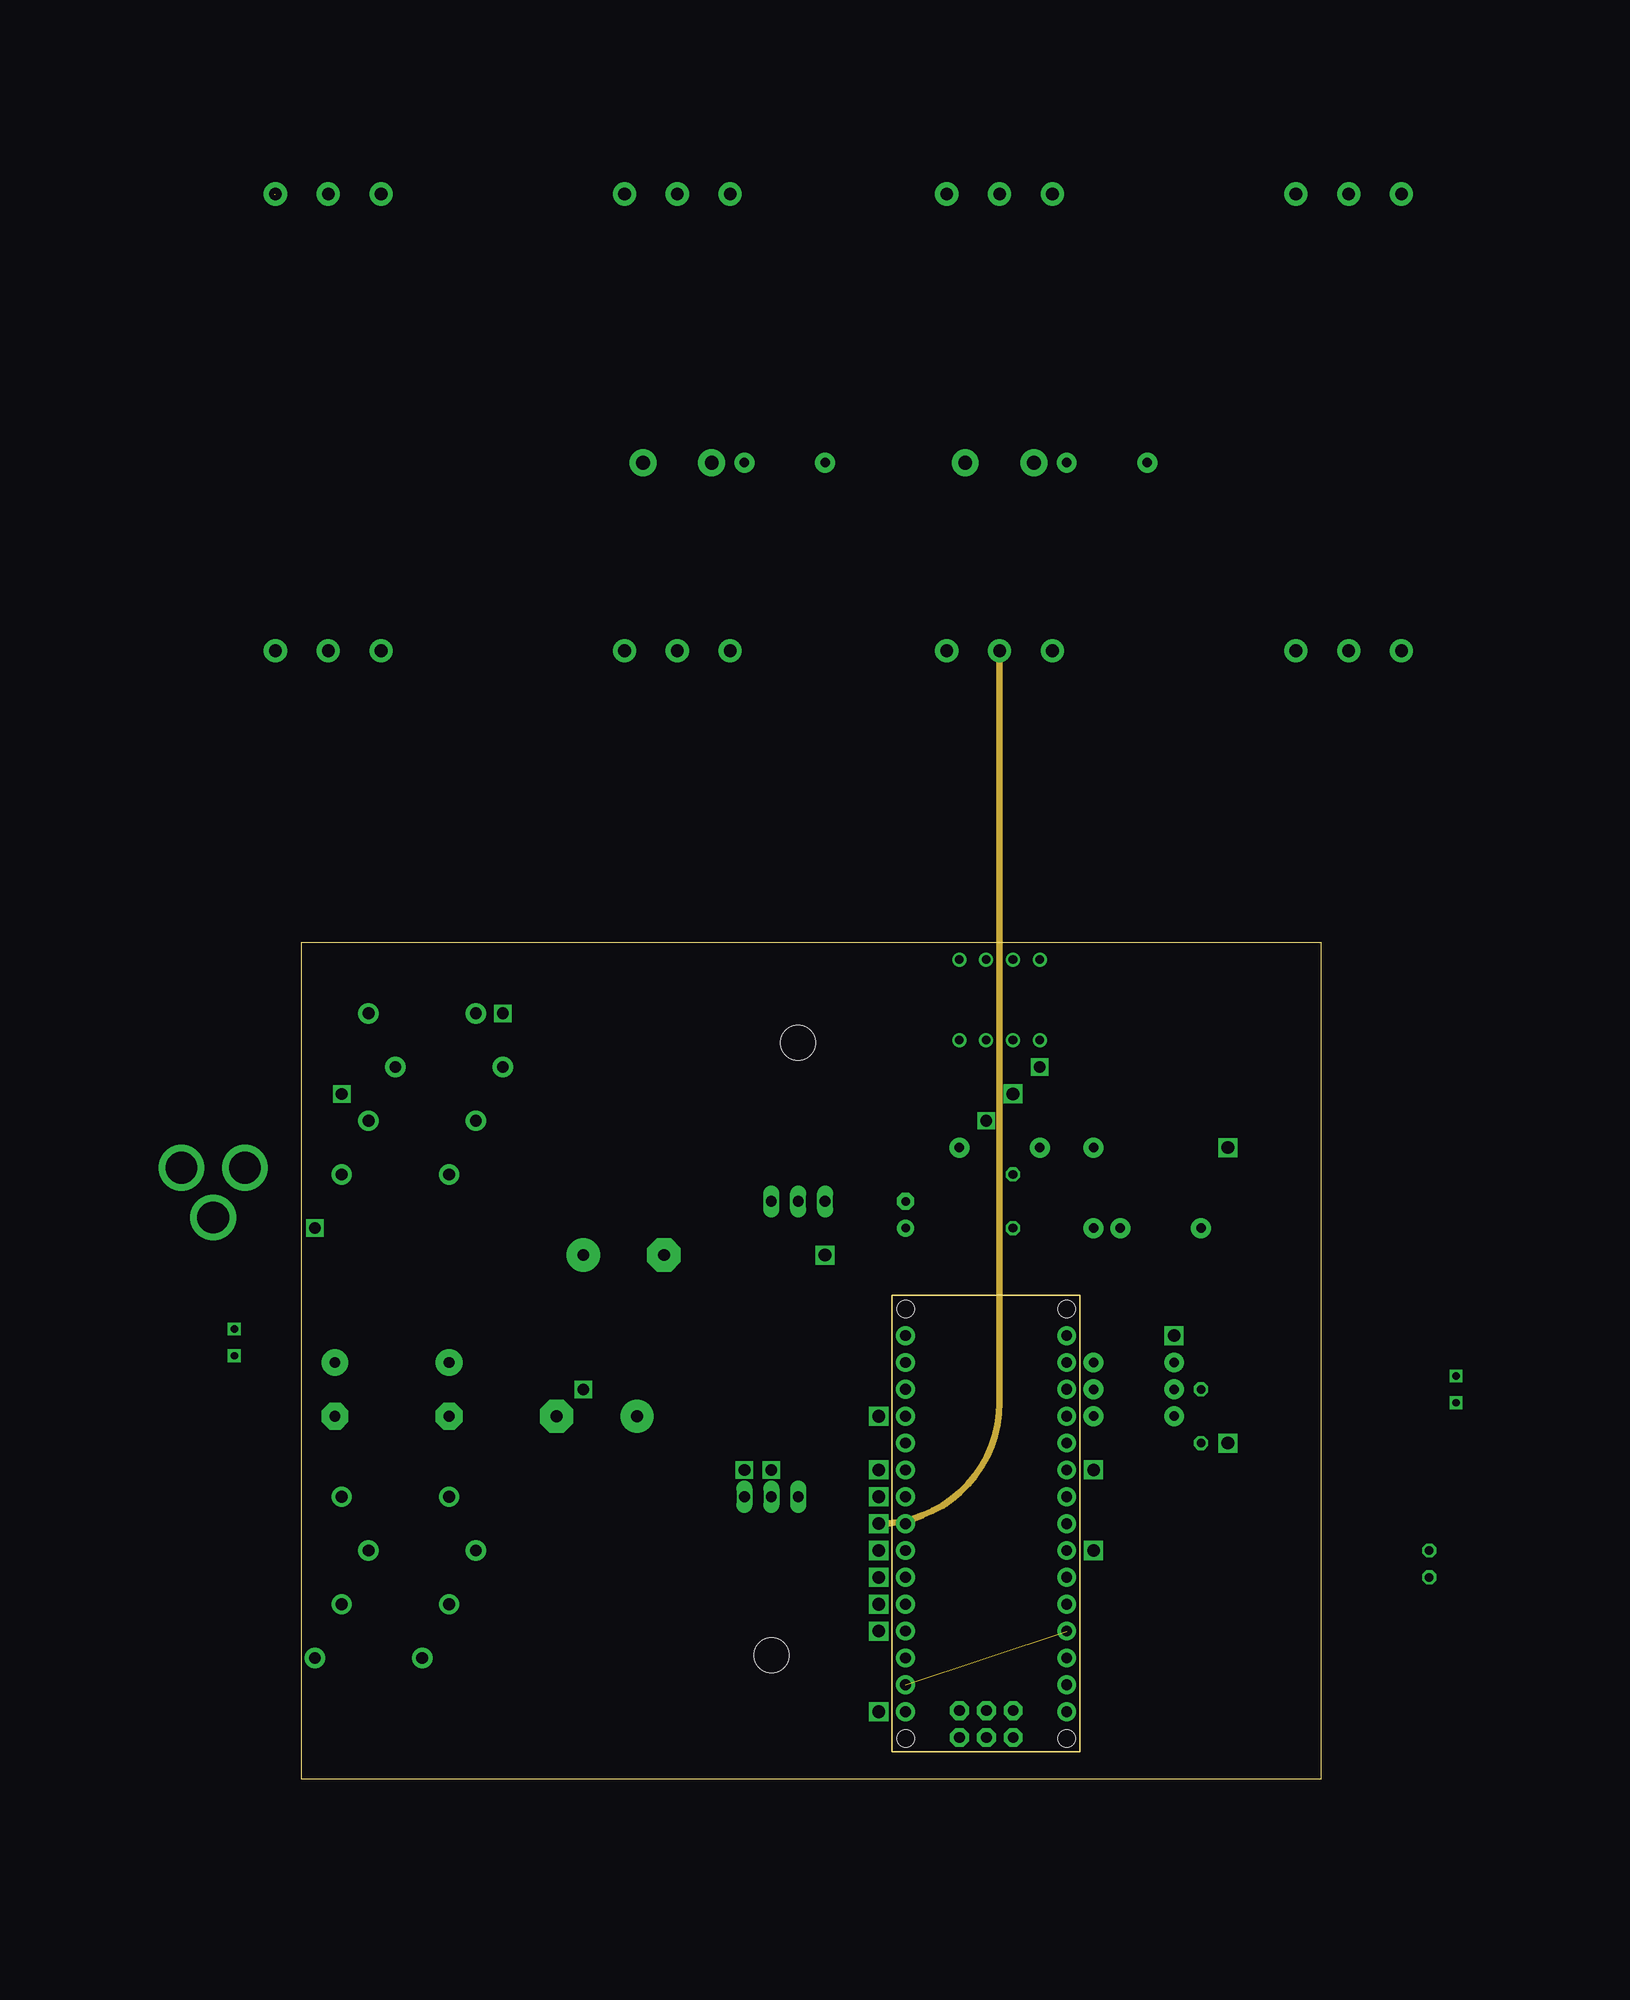
[diagram p9: board, inner layer Pots]
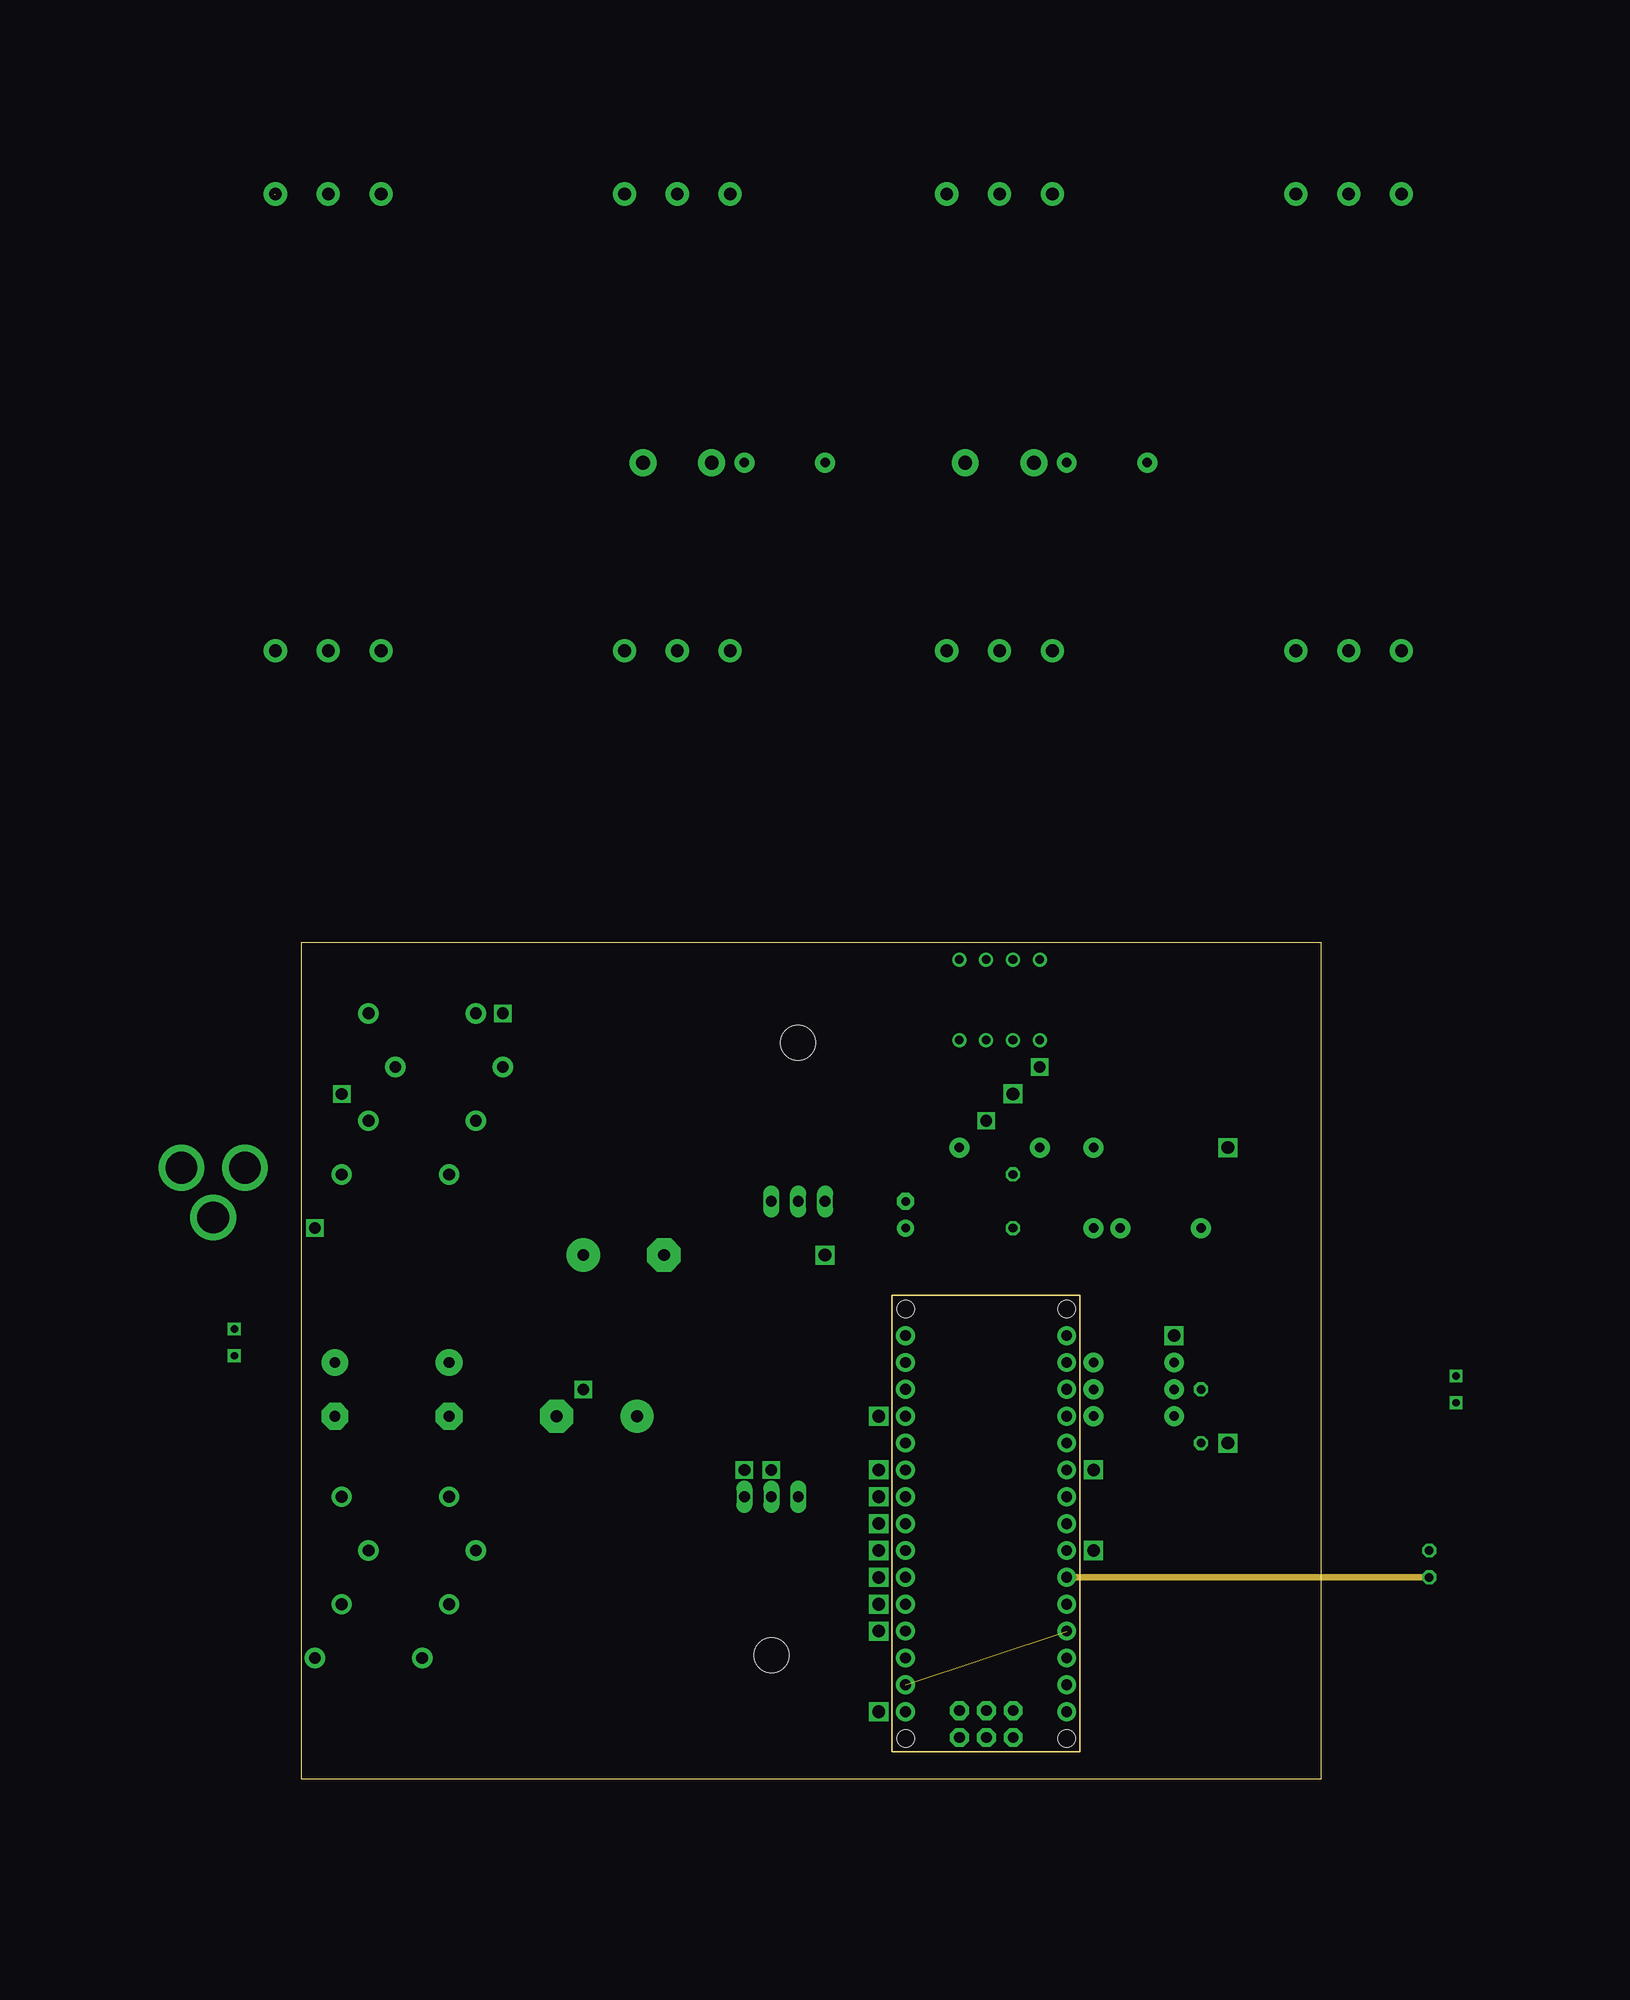
[diagram p10: board, inner layer Led&Switches]
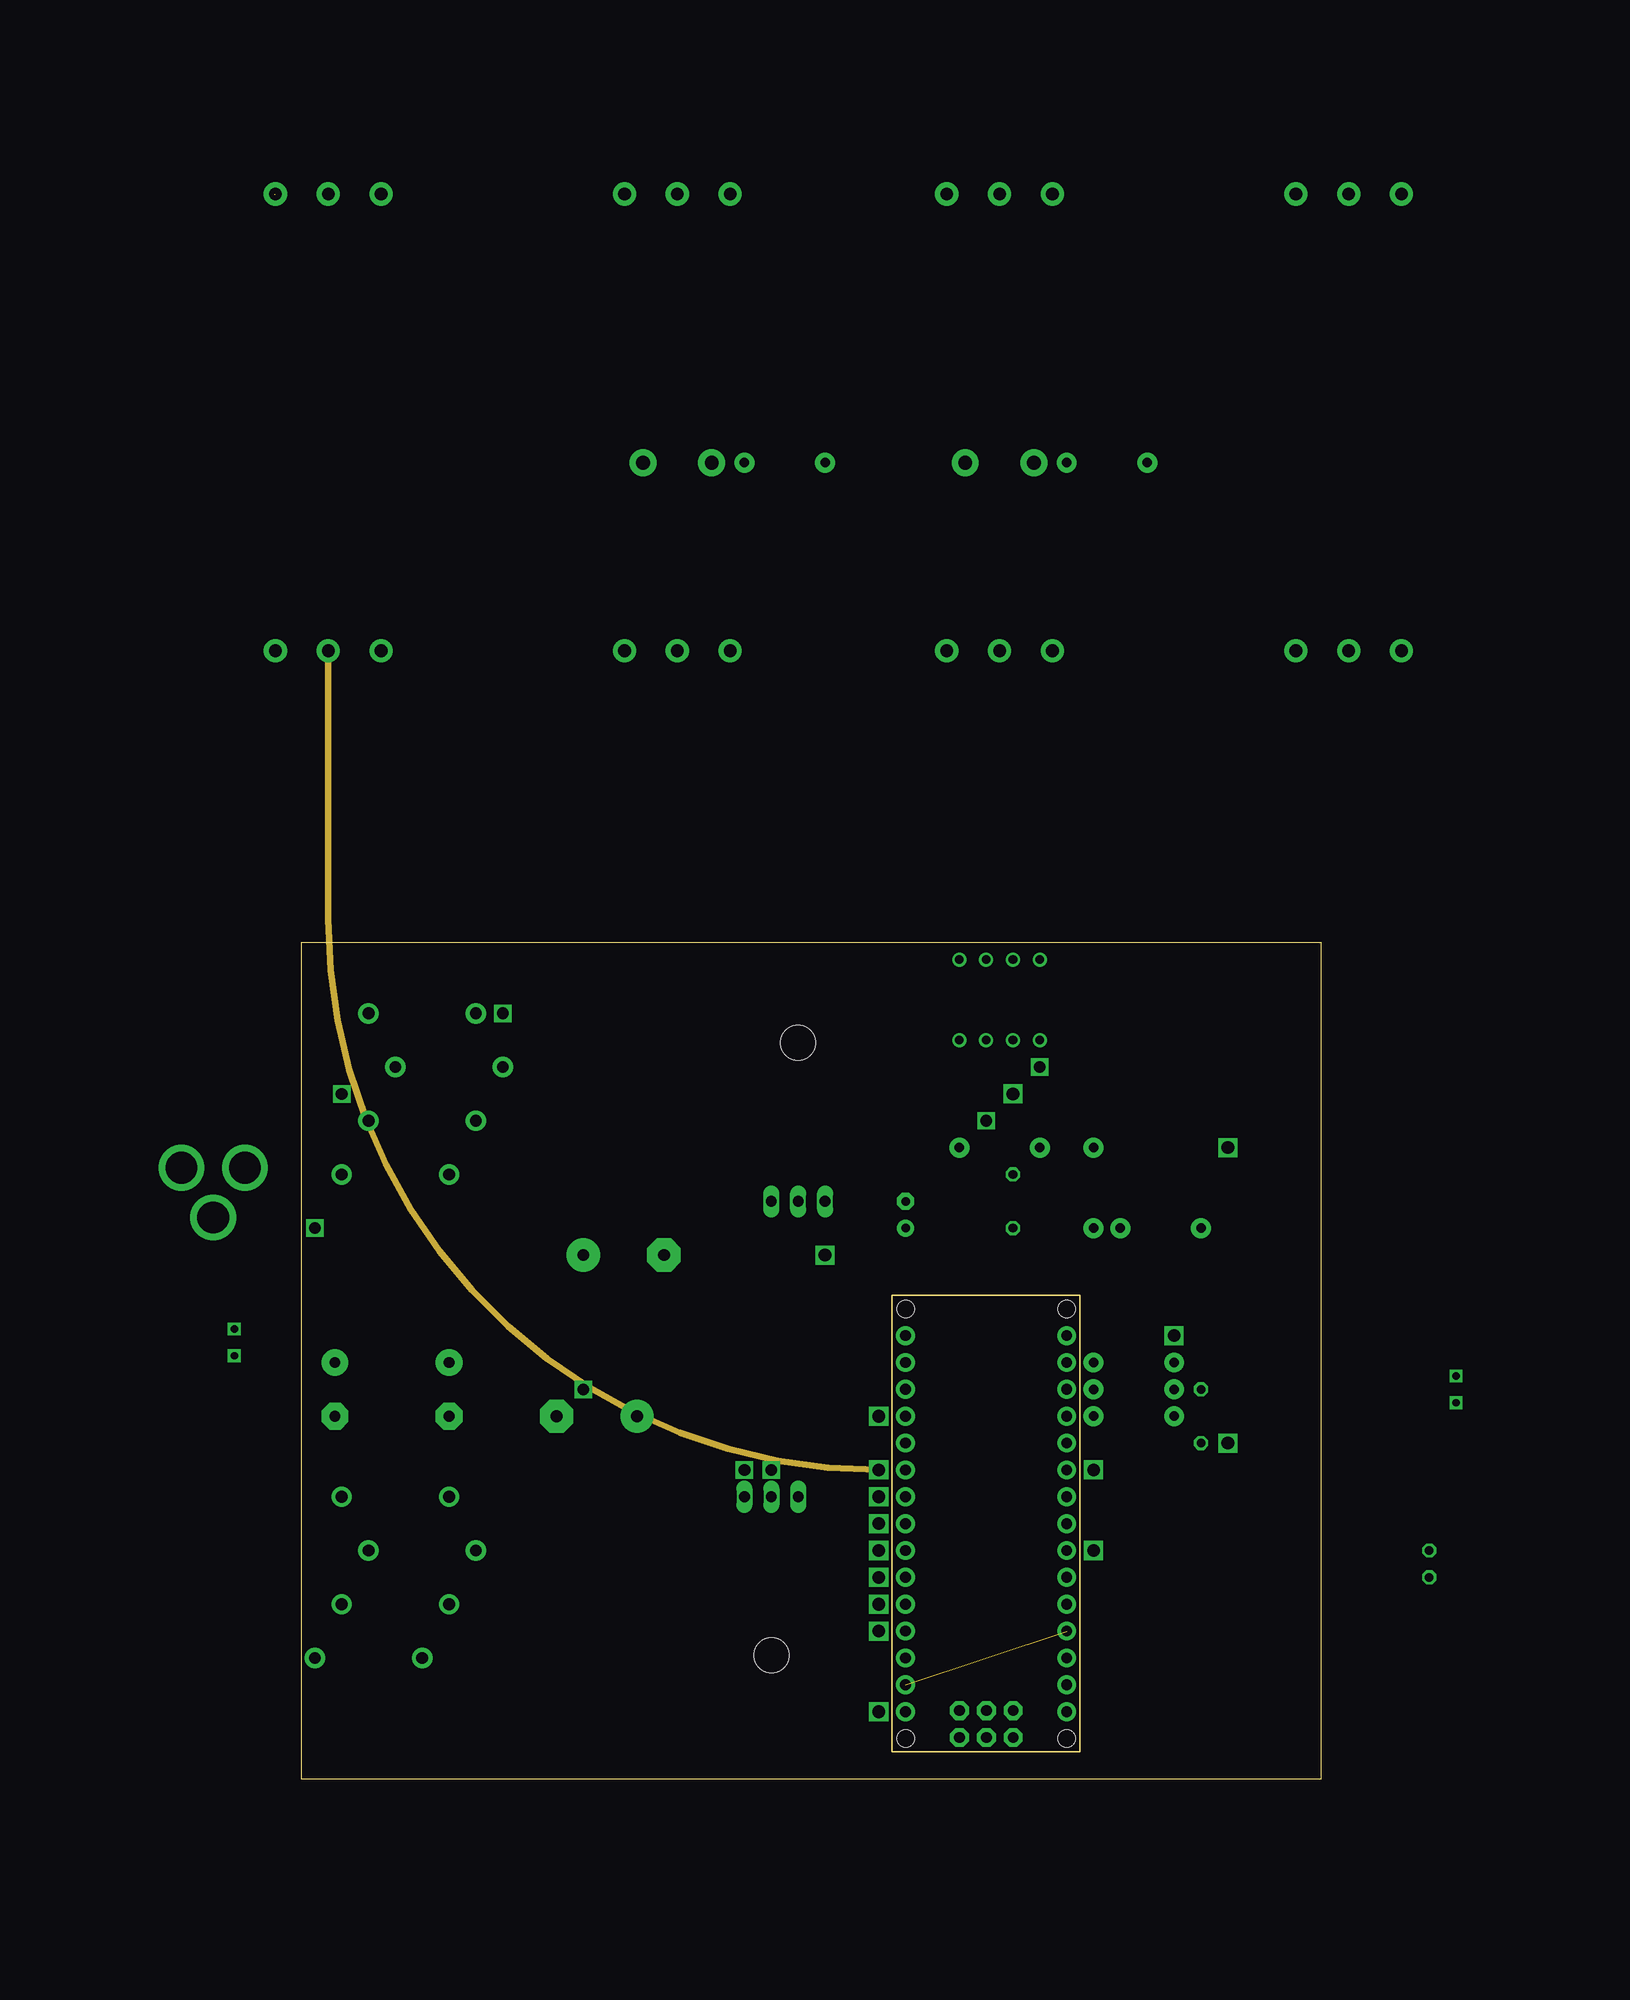
[diagram p11: board, inner layer Route11]
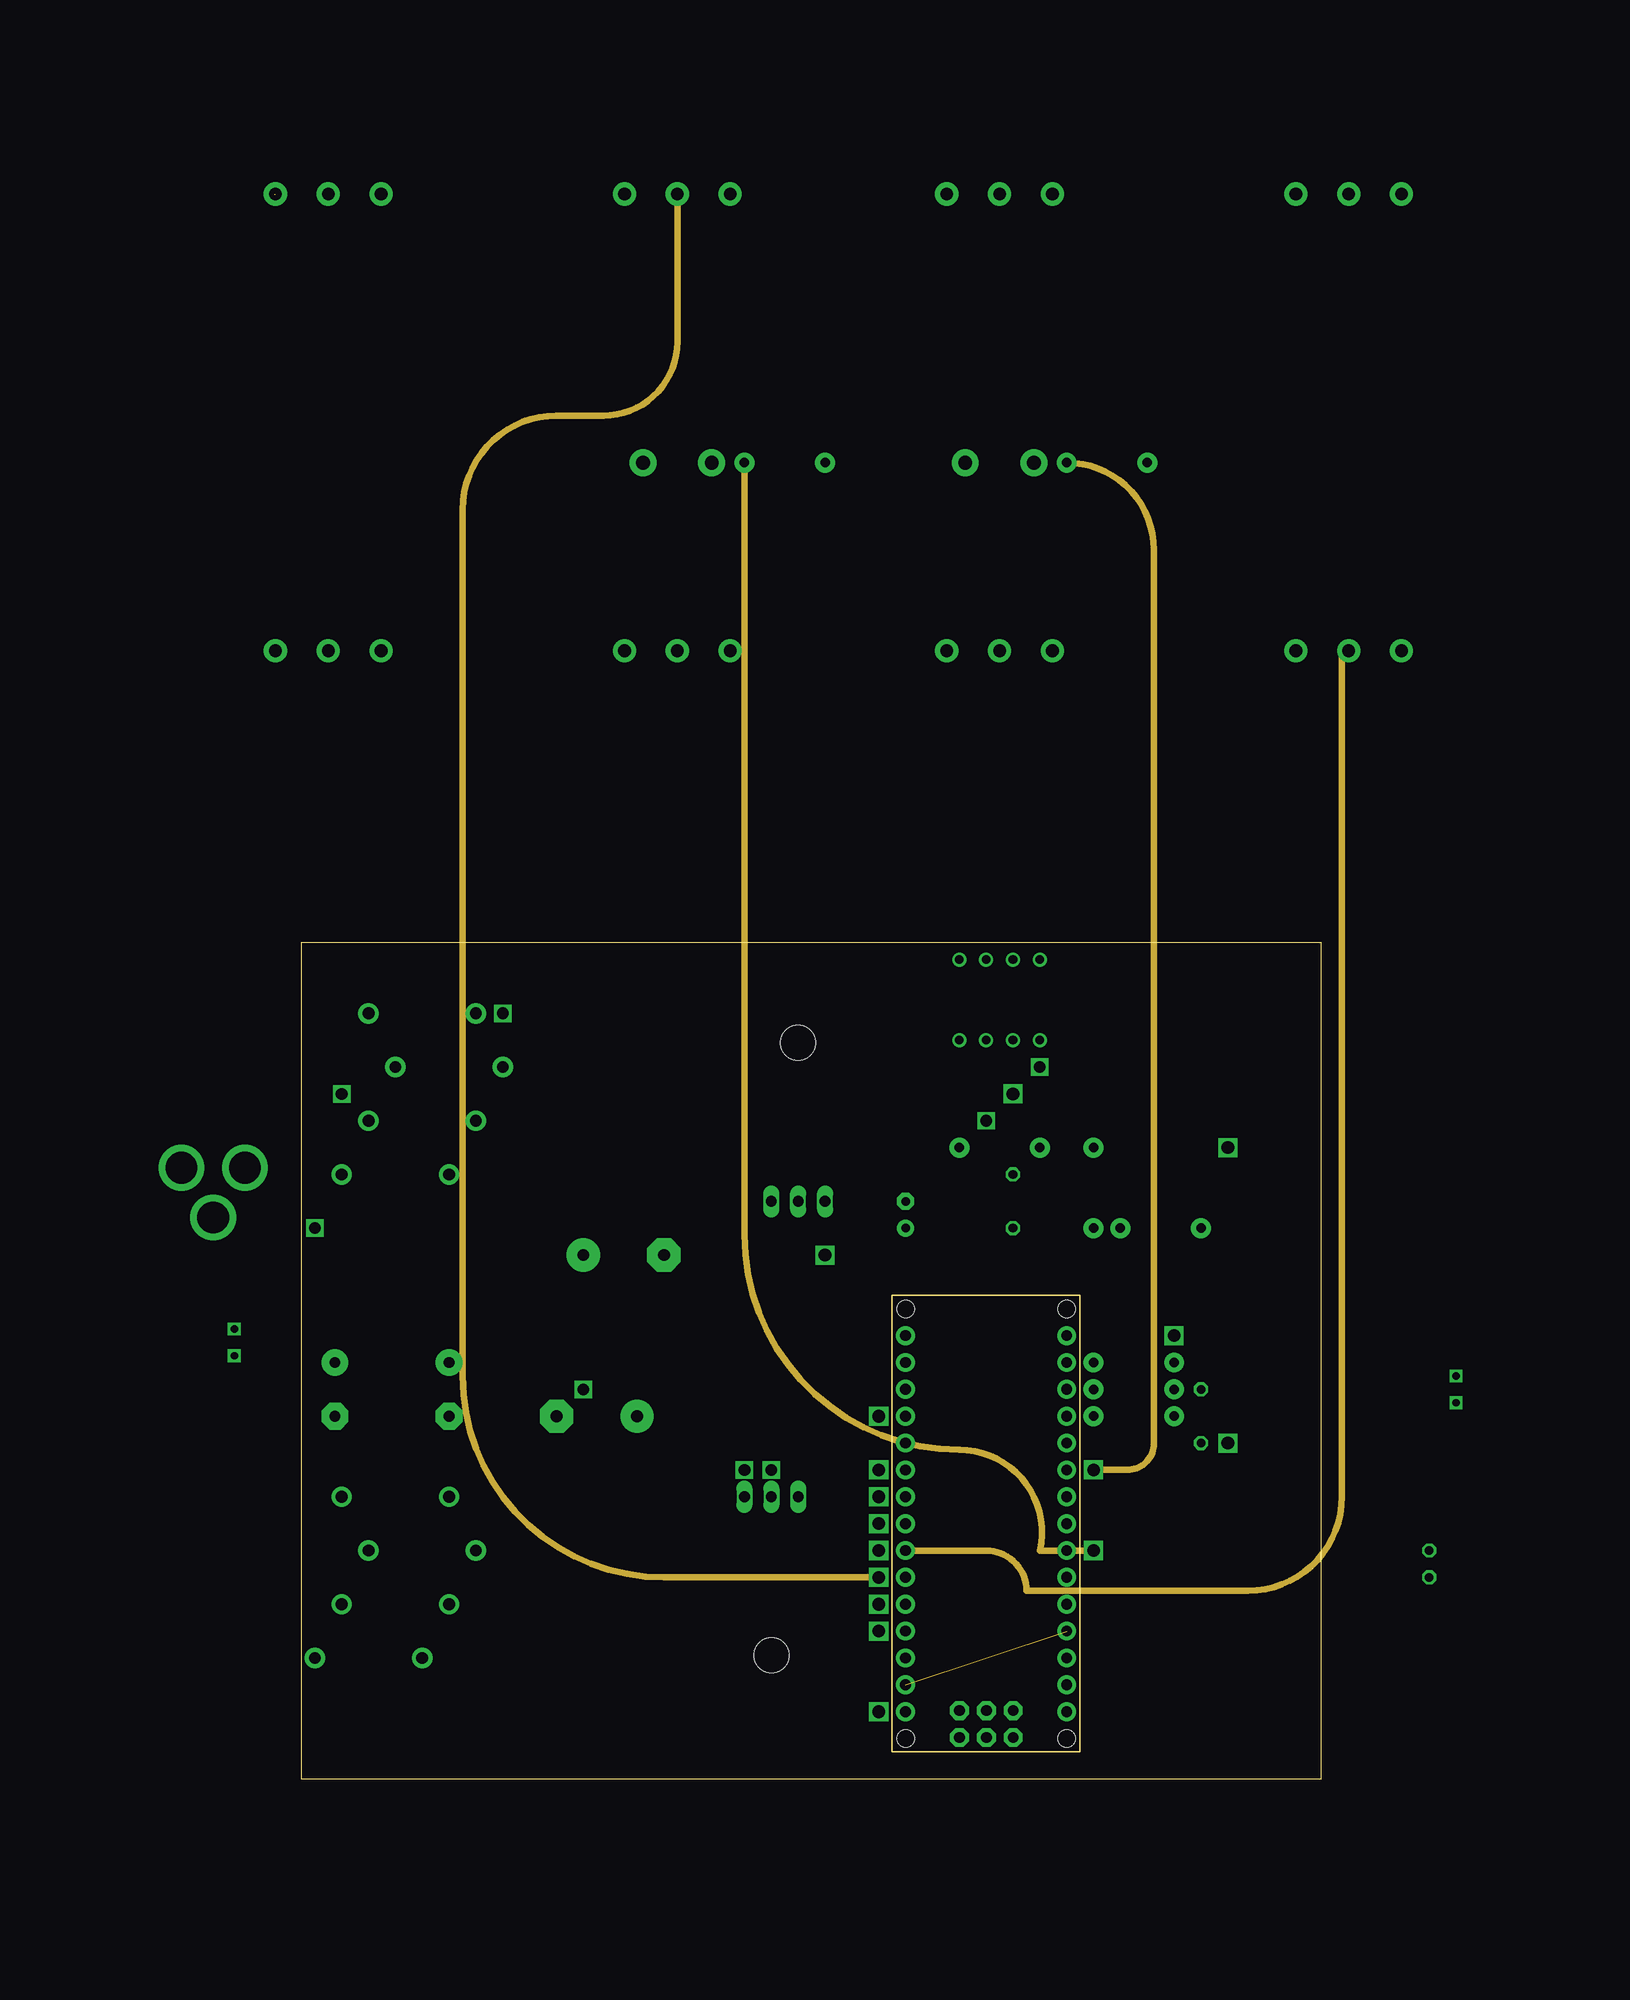
[diagram p12: board, inner layer Route12]
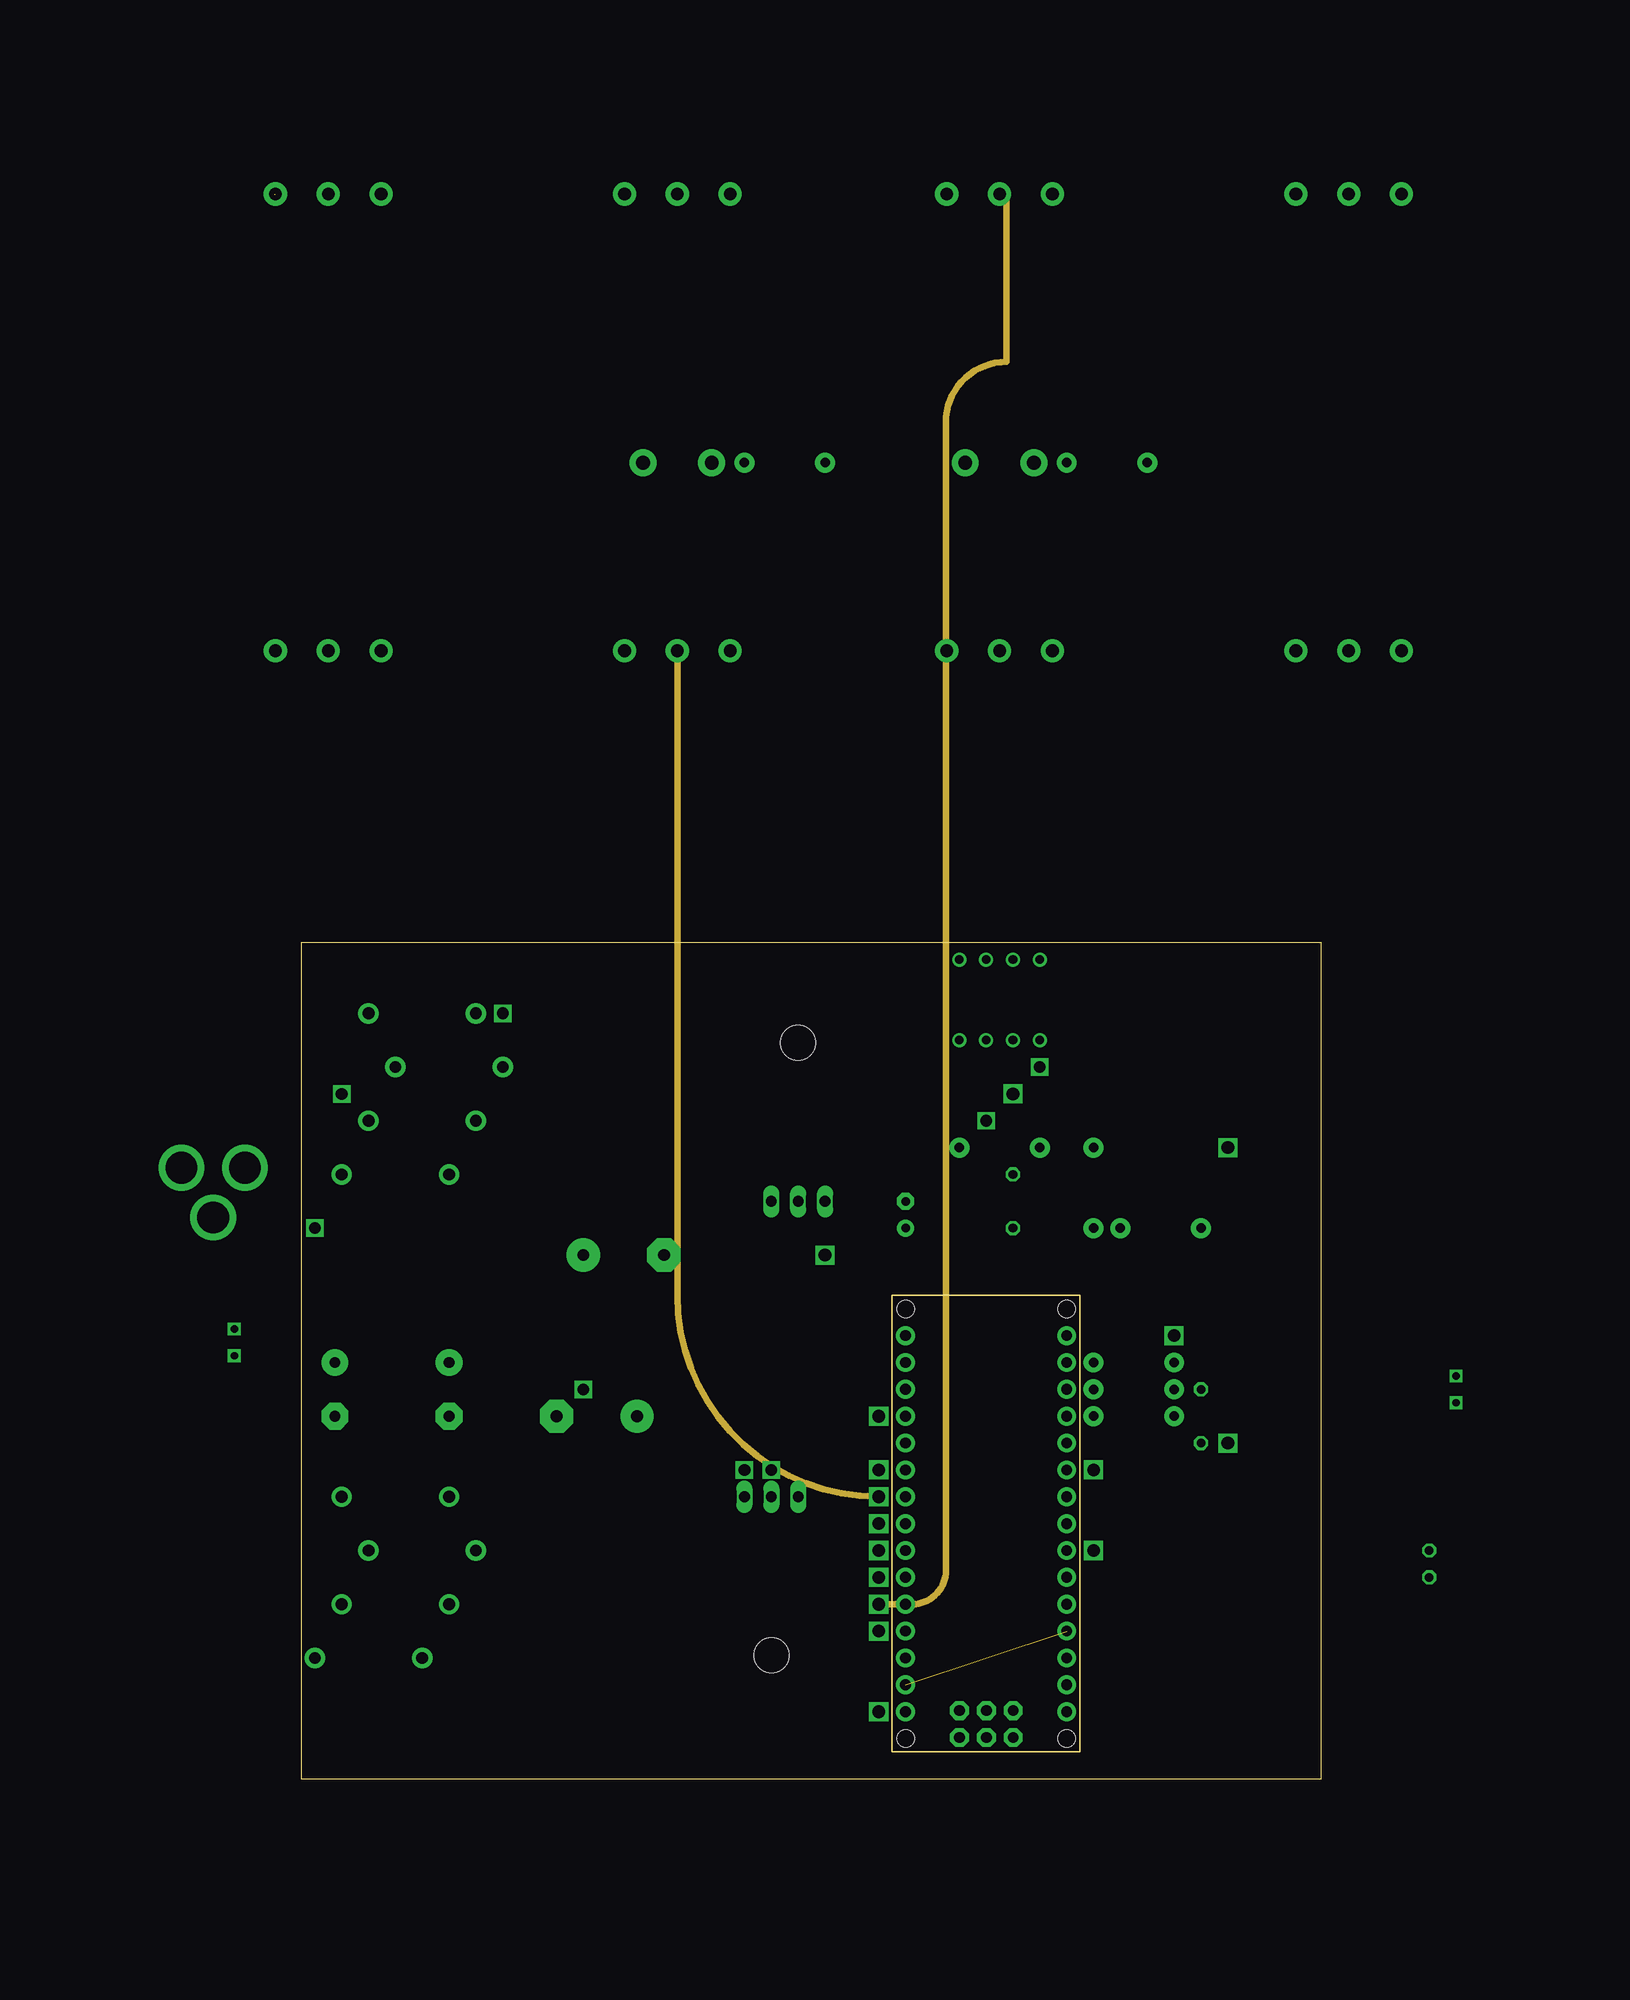
[diagram p13: board, inner layer Route13]
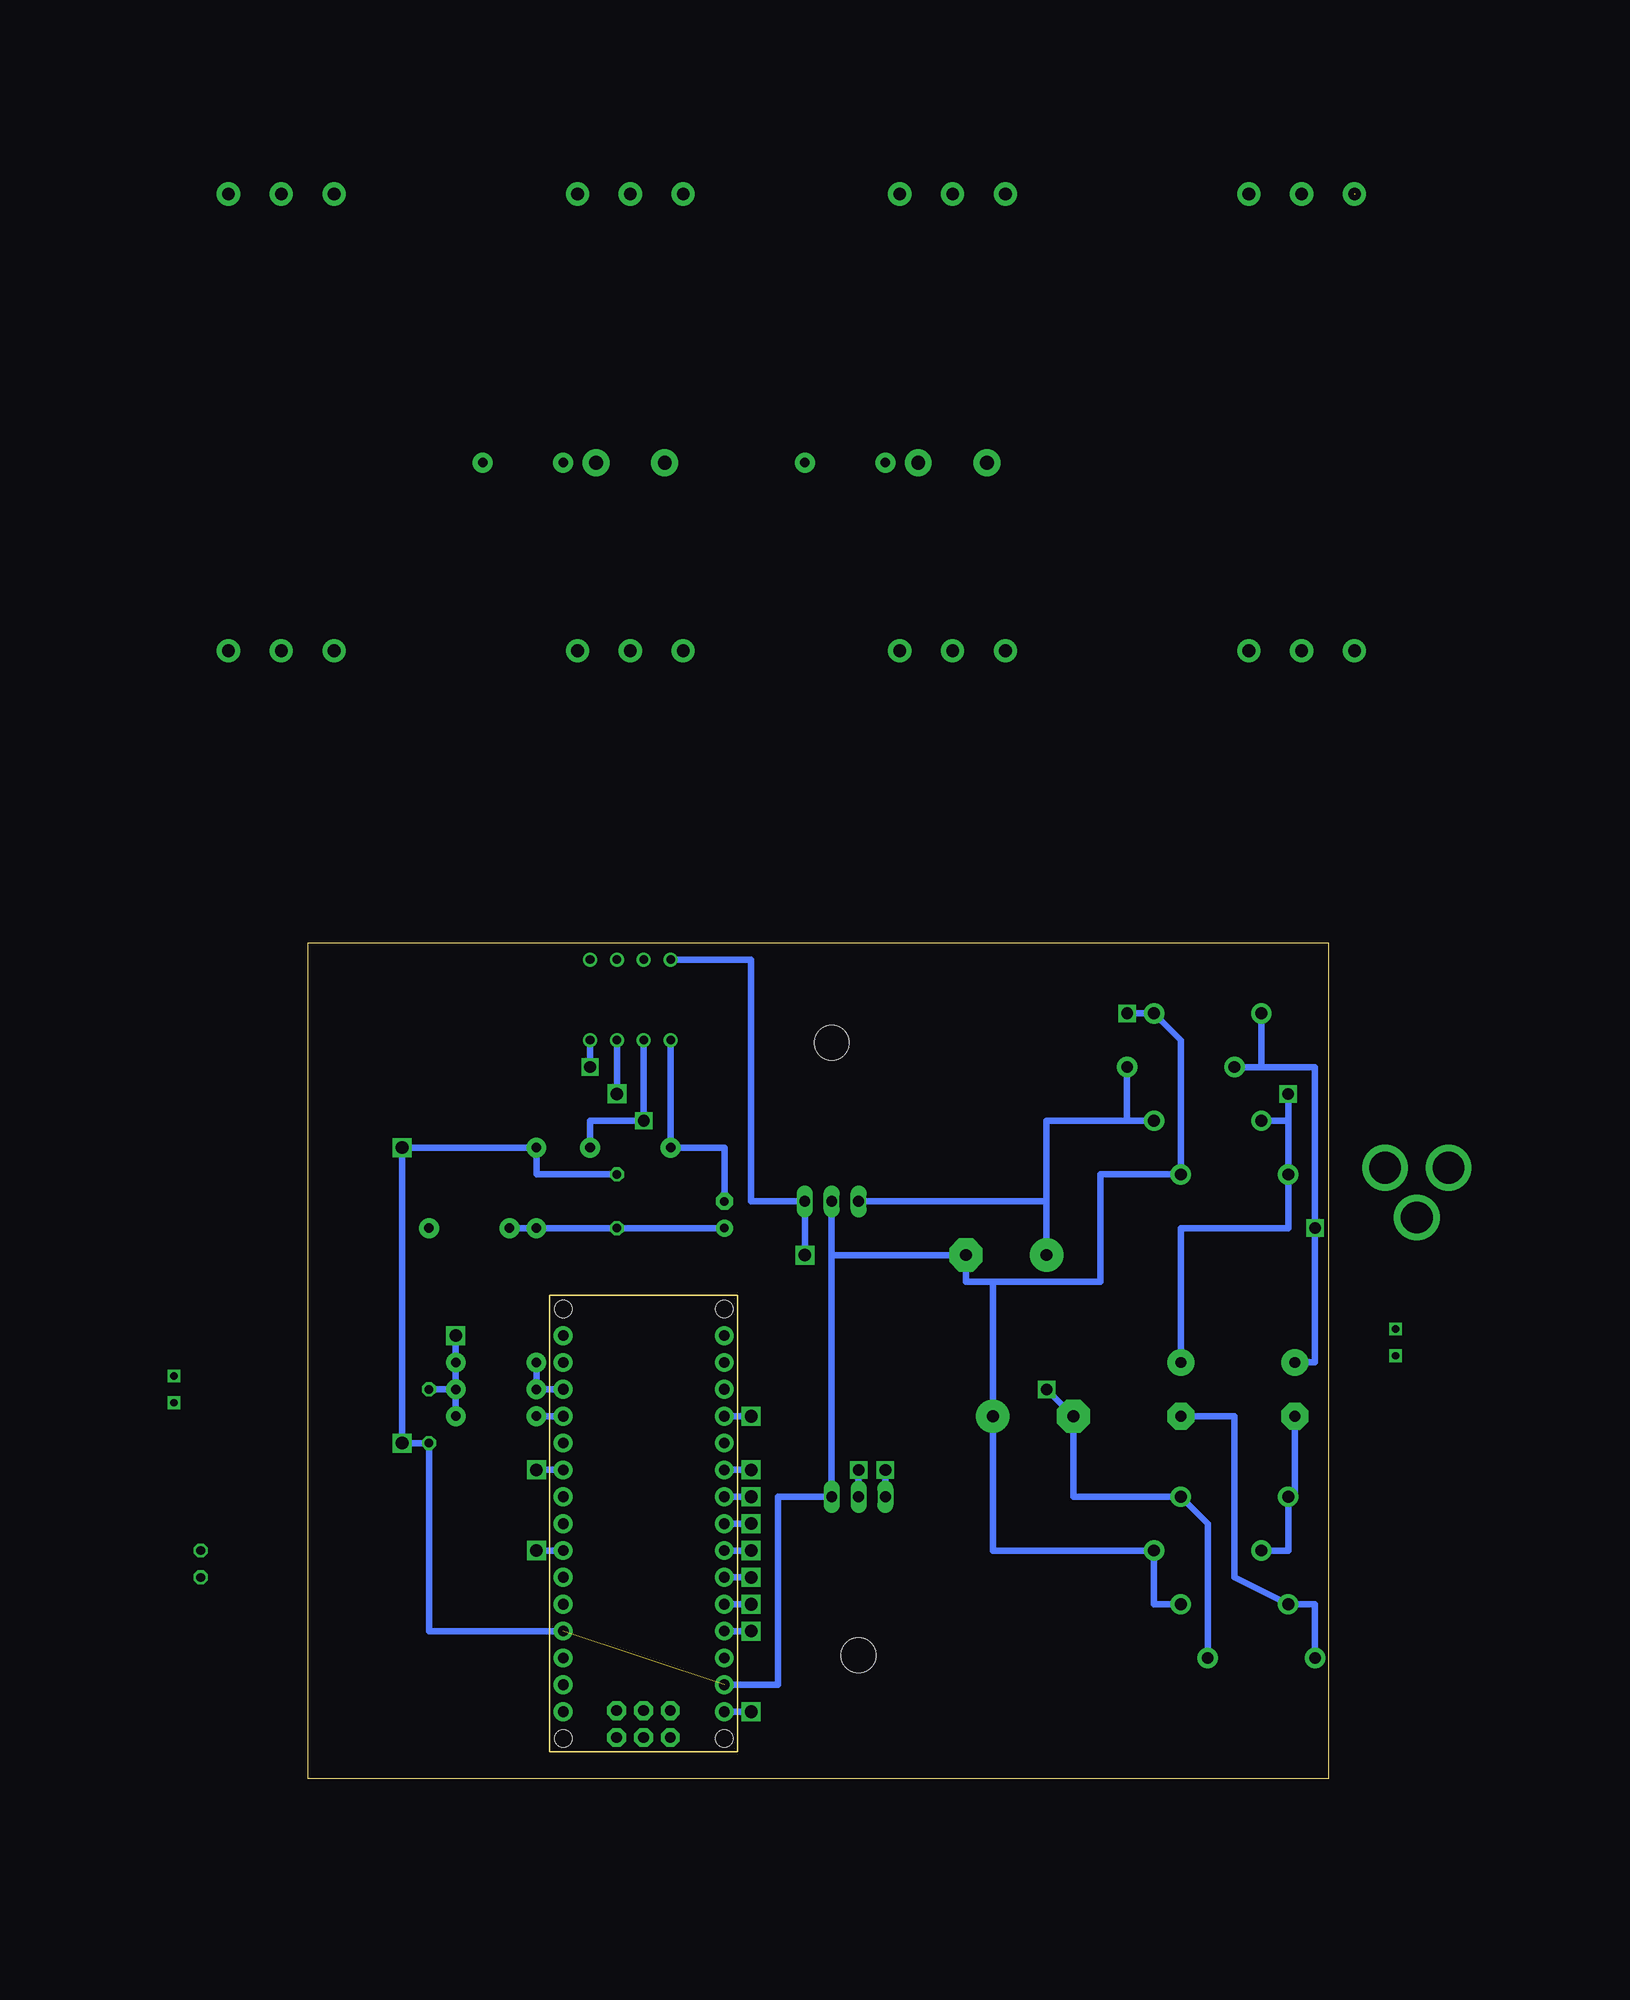
[diagram p14: board, bottom side, seen from below]

Size 96.5 x 79.05 mm. Coordinates in mm from the lower left corner, seen from the top.
Outline: 0,0 96.5,0 96.5,79.05 0,79.05 0,0
Copper layers (1+2+3+4+5+6+7+8+9+10+11+12+13+14+15+16): Top 0.035mm / dielectric 1.5mm / Ground 0.035mm / dielectric 0.15mm / 5V 0.035mm / dielectric 0.2mm / Component2Component 0.035mm / dielectric 0.15mm / +9V 0.035mm / dielectric 0.2mm / OnBoardWire1 0.035mm / dielectric 0.15mm / OnBoardWire2 0.035mm / dielectric 0.2mm / Audio 0.035mm / dielectric 0.15mm / Pots 0.035mm / dielectric 0.2mm / Led&Switches 0.035mm / dielectric 0.15mm / Route11 0.035mm / dielectric 0.2mm / Route12 0.035mm / dielectric 0.15mm / Route13 0.035mm / dielectric 0.2mm / Route14 0.035mm / dielectric 0.15mm / DummyGND 0.035mm / dielectric 0.2mm / Bottom 0.035mm
Design rules "default *": minimum track width 10mil, minimum drill 24mil, track to track 8mil, track to pad 8mil, pad to pad 8mil, via to via 8mil, smd to smd 8mil, copper to edge 40mil, drill to drill 8mil, minimum pad ring 10mil, minimum via ring 8mil, stop-mask expansion 4mil, vias tented up to drill 0mil, thermal gap 10mil

### Footprints (pad centres in the part's own frame; a part is rotated, then mirrored left to right if it is on the bottom)
C050-025X075 = drill 0.813 octagon: 1 -2.54,0; 2 2.54,0
E30-16 = drill 1.118 pad 3.15: + -19.05,6.35 | drill 1.118 pad 3.15 octagon: - -19.05,-1.27
E35-16 = drill 1.118 pad 3.15: + -16.51,3.81 | drill 1.118 pad 3.15 octagon: - -16.51,-3.81
E5-10,5 = drill 1.016 pad 2.54: + -2.54,0 | drill 1.016 pad 2.54 octagon: - 2.54,0
E2,5-6 = drill 0.813 pad 1.6: + -1.27,0 | drill 0.813 pad 1.6 octagon: - 1.27,0
DO41-10 = drill 1.118 pad 1.93: A 5.08,0; C -5.08,0
79XXL = drill 1.016 long: GND -2.54,-3.81; IN 0,-3.81; OUT 2.54,-3.81 | hole 3.302: 0,11.176
78XXL = drill 1.016 long: GND 0,-3.81; IN -2.54,-3.81; OUT 2.54,-3.81 | hole 3.302: 0,11.176
DIL08 = drill 0.813 pad 1.27: 1 -3.81,-3.81; 2 -1.27,-3.81; 3 1.27,-3.81; 4 3.81,-3.81; 5 3.81,3.81; 6 1.27,3.81; 7 -1.27,3.81; 8 -3.81,3.81
TWO_PADS = drill 0.7 square: SLEEVE -1.27,0; TIP 1.27,0
POWER_JACK_PTH = drill 2.997 pad 4.318: GND 0,7.7; GNDBREAK 4.7,10.7; PWR 0,13.7
LED3MM = drill 0.813 octagon: A -1.27,0; K 1.27,0
3RP/1610N = drill 1.2 pad 2.184: 1 -5,0; 2 0,0; 3 5,0
ARDUINO_NANO = drill 1.016 pad 1.778: 3V3 6.35,1.27; 5V 31.75,1.27; A0 11.43,1.27; A1 13.97,1.27; A2 16.51,1.27; A3 19.05,1.27; A4 21.59,1.27; A5 24.13,1.27; A6 26.67,1.27; A7 29.21,1.27; D2 29.21,16.51; D3 26.67,16.51; D4 24.13,16.51; D5 21.59,16.51; D6 19.05,16.51; D7 16.51,16.51; D8 13.97,16.51; D9 11.43,16.51; D10 8.89,16.51; D11 6.35,16.51; D12 3.81,16.51; D13 3.81,1.27; GND 31.75,16.51; GND. 36.83,1.27; REF 8.89,1.27; RST 34.29,16.51; RST. 34.29,1.27; RX1 36.83,16.51; TX1 39.37,16.51; VIN 39.37,1.27 | drill 1.016 pad 1.778 octagon: 5V. 39.268,6.375; GND_ 39.268,11.455; MISO 41.808,6.375; MOSI 39.268,8.915; RESET.. 41.808,11.455; SCK 41.808,8.915 | smd 1.27 x 0.635: <USB>+V 7.214,10.947; <USB>D+ 7.214,9.957; <USB>D- 7.214,8.941; <USB>GND 7.214,6.96; <USB>ID 7.214,7.976 | hole 1.651: 1.27,1.27; 1.27,16.51; 41.91,16.51; 41.91,1.27
AXIAL-0.3 = drill 0.9 pad 1.88: P$1 -3.81,0; P$2 3.81,0
TACT_PANA-EVQ = drill 1.3 pad 2.54: P$1 -3.25,0; P$2 3.25,0

### Placement (x,y rotation side)
C1  85.09,34.29 270 top
C2  33.02,68.58 90 top
C3  27.94,17.78 270 top
C4  13.97,36.83 270 top
C5  3.17,36.83 270 top
C6  67.31,54.61 90 top
C7  57.15,53.34 90 top
D1  11.43,72.39 0 top
D2  13.97,67.31 180 top
D3  11.43,62.23 180 top
D4  8.89,57.15 0 top
D5  8.89,26.67 0 top
D6  11.43,21.59 180 top
D7  8.89,16.51 180 top
D8  6.35,11.43 0 top
IC1  44.45,22.86 180 top
IC2  46.99,58.42 0 top
IC3  66.04,73.66 0 top
JIN  -6.35,41.27 270 top  (outside the outline)
JOUT  109.22,36.83 90 top  (outside the outline)
JPWR  -19.05,57.78 270 top  (outside the outline)
LED1  106.68,20.32 90 top  (outside the outline)
P1  2.54,106.68 0 top  (outside the outline)
P2  35.56,106.68 0 top  (outside the outline)
P3  66.04,106.68 0 top  (outside the outline)
P4  99.06,106.68 0 top  (outside the outline)
P5  35.56,149.86 0 top  (outside the outline)
P6  66.04,149.86 0 top  (outside the outline)
PCB1  55.88,45.72 270 top
PVIN  2.54,149.86 0 top  (outside the outline)
PVOUT  99.06,149.86 0 top  (outside the outline)
R1  78.74,34.29 180 top
R2  78.74,39.37 180 top
R3  78.74,36.83 180 top
R4  66.04,59.69 180 top
R5  81.28,52.07 0 top
R6  74.93,55.88 270 top
R7  45.72,124.46 0 top  (outside the outline)
R8  76.2,124.46 0 top  (outside the outline)
SW1  35.56,124.46 0 top  (outside the outline)
SW2  66.04,124.46 0 top  (outside the outline)

### Tracks (layer width: path | path; a pad name or v marks a point on that pad's centre or on a via)
+5V  (via drill 1.2)
  5V 0.61: P1.3 7.54,94.06 arc90 15.24,86.36 35.56,86.36 arc90 40.64,91.44 40.64,106.6 arc90 P2.3 42.55,106.68 arc90 49.53,113.67 R7.P$2 49.53,140.89 arc90 P5.3 arc-90 55.8,165.1 63.5,165.1 arc-90 71.04,157.56 P6.3 arc-90 80.01,140.89 R8.P$2 | R8.P$2 95.25,124.46 arc-90 104.14,115.57 104.14,106.76 arc-90 P4.3 | R8.P$2 80.01,115.65 arc-90 P3.3 arc-90 85.09,92.63 R5.P$2 arc-90 91.44,45.72 91.44,-4.45 arc-90 88.27,-7.62 52.7,-7.62 arc-90 48.26,-3.17 48.26,7.62 arc-90 v54.61,13.97
  Bottom 0.61: v54.61,13.97 PCB1.5V
+9V  (via drill 1.2)
  +9V 0.61: v49.53,49.53 49.53,8.89 arc90 52.07,6.35 v54.61,6.35
  Bottom 0.61: IC3.8 54.61,77.47 54.61,54.61 IC2.OUT v49.53,49.53 | v54.61,6.35 PCB1.VIN
-9V  (via drill 1.1)
  OnBoardWire2 0.61: v41.91,29.21 41.91,30.48 arc-90 53.34,46.99 59.05,46.99 arc90 72.39,55.24 72.39,62.23 arc90 v69.85,67.31
  Bottom 0.61: IC1.OUT v41.91,29.21 | IC3.4 v69.85,67.31
GND  (via drill 1.1, 1.2)  (2 unrouted)
  Ground 0.61: -2.54,149.86 -2.54,106.68 P1.1 arc90 -2.54,106.6 -2.62,106.6 arc90 -25.4,83.82 -25.4,55.88 arc90 -15.24,45.72 -10.79,45.72 arc-90 -6.35,41.27 JIN.SLEEVE | PVIN.1 -2.46,152.48 arc-90 5.08,160.02 20.4,160.02 arc-90 P5.1 30.56,152.48 arc-90 38.1,160.02 50.88,160.02 arc-90 P6.1 61.04,149.94 arc-90 68.58,157.48 86.36,157.48 arc-90 93.98,149.86 PVOUT.1 arc-90 73.74,129.54 66.04,129.54 | SW2.P$1 62.79,126.29 arc-90 66.04,129.54 | 66.04,129.54 35.56,129.54 arc90 32.31,126.29 SW1.P$1 arc90 30.48,122.63 30.48,106.68 P2.1 30.56,91.36 arc90 33.02,88.9 43.26,88.9 arc90 P3.1 61.04,93.9 arc90 66.04,88.9 76.28,88.9 arc90 P4.1 arc-90 93.98,106.76 93.98,114.3 arc-90 96.52,116.84 101.6,116.84 arc-90 116.84,101.6 116.84,40.64 arc-90 JOUT.SLEEVE | JOUT.SLEEVE 109.22,26.67 arc-90 106.68,24.13 LED1.K | JOUT.SLEEVE 106.68,35.56 arc-90 102.87,31.75 v87.63,31.75
  Bottom 0.61: D7.C 16.51,16.51 D6.C 31.75,21.59 C3.+ 31.75,46.99 | v19.05,72.39 D1.A 13.97,69.85 D4.A 21.59,57.15 21.59,46.99 31.75,46.99 | 46.99,49.53 C2.- 34.29,46.99 31.75,46.99 | 46.99,49.53 IC2.GND | 46.99,49.53 IC1.GND 52.07,26.67 52.07,8.89 PCB1.GND. | C6.2 74.93,57.15 R6.P$1 v87.63,59.69 v87.63,31.75 C1.2 85.09,13.97 PCB1.GND
IN  (via drill 1.2)
  OnBoardWire1 0.61: C7.+ 55.88,52.07 arc90 54.61,50.8 v54.61,34.29
  Bottom 0.61: C7.+ C6.1 R6.P$2 R5.P$1 | PCB1.A0 v54.61,34.29
JL1
  Led&Switches 0.61: LED1.A PCB1.D3
JP1  (via drill 1.2)
  Route11 0.61: P1.2 2.54,81.28 arc90 v54.61,29.21
  Bottom 0.61: v54.61,29.21 PCB1.A2
JP2  (via drill 1.2)
  Route13 0.61: P2.2 35.56,45.72 arc90 v54.61,26.67
  Bottom 0.61: v54.61,26.67 PCB1.A3
JP3  (via drill 1.2)
  Pots 0.61: P3.2 66.04,35.56 arc-90 v54.61,24.13
  Bottom 0.61: v54.61,24.13 PCB1.A4
JP4  (via drill 1.2)
  Route12 0.61: P4.2 arc90 98.42,106.05 98.42,26.67 arc-90 89.53,17.78 68.58,17.78 arc90 64.77,21.59 PCB1.A5
  Bottom 0.61: v54.61,21.59 PCB1.A5
JP5  (via drill 1.2)
  Route12 0.61: P5.2 35.56,135.89 arc-90 28.57,128.91 24.13,128.91 arc90 15.24,120.02 15.24,38.1 arc90 34.29,19.05 v54.61,19.05
  Bottom 0.61: v54.61,19.05 PCB1.A6
JP6  (via drill 1.2)
  Route13 0.61: P6.2 arc-90 66.67,149.22 66.67,133.99 arc90 60.96,128.27 60.96,19.68 arc-90 57.78,16.51 v54.61,16.51
  Bottom 0.61: v54.61,16.51 PCB1.A7
JP8-2  (via drill 1.2)
  Audio 0.61: v82.55,41.91 arc90 109.86,69.22 109.86,131.44 arc-90 99.06,142.24 PVOUT.2
  Bottom 0.61: R1.P$1 R3.P$1 | R3.P$1 R2.P$1 v82.55,41.91 | R3.P$1 C1.1
JP8-3
  Audio 0.61: PVOUT.3 arc-90 121.92,139.62 122.56,50.8 arc-90 JOUT.TIP
JS1  (via drill 1.2)
  Component2Component 0.61: SW1.P$2 R7.P$1
  Route12 0.61: R7.P$1 41.91,51.44 arc90 62.23,31.11 arc-103 69.85,21.59 v74.93,21.59
  Bottom 0.61: v74.93,21.59 PCB1.D4
JS2  (via drill 1.2)
  Component2Component 0.61: R8.P$1 SW2.P$2
  Route12 0.61: R8.P$1 arc-90 80.64,116.2 80.64,31.75 arc-90 78.11,29.21 v74.93,29.21
  Bottom 0.61: v74.93,29.21 PCB1.D7
MZ1
  Bottom 0.61: R1.P$2 PCB1.D9
MZ2
  Bottom 0.61: PCB1.D10 R3.P$2 R2.P$2
N$2
  Bottom 0.61: D6.A 3.81,21.59 D5.C 3.17,26.67 C5.-
N$4
  Bottom 0.61: D8.C 1.27,16.51 D7.A 8.89,19.05 8.89,34.29 C4.-
N$5
  Bottom 0.61: D3.C 19.05,62.23 | 19.05,62.23 D2.C | 19.05,62.23 26.67,62.23 26.67,54.61 | 26.67,54.61 C2.+ | IC2.IN 26.67,54.61
N$7  (via drill 1.1)
  OnBoardWire1 0.61: v44.45,29.21 44.45,30.48 arc90 40.64,36.83 v26.67,36.83
  Bottom 0.61: D8.A 11.43,24.13 D5.A 24.13,26.67 C3.- v26.67,36.83 | IC1.IN v44.45,29.21
N$8
  Bottom 0.61: IC3.1 R4.P$2 57.15,59.69 C7.-
N$9  (via drill 1.1)
  Audio 0.61: PVIN.2 arc-90 22.86,129.54 22.86,83.82 arc90 33.02,81.28 38.1,81.28 arc-90 52.07,67.31 52.07,63.5 arc90 53.34,62.23 v64.77,62.23
  Bottom 0.61: R4.P$1 69.85,62.23 v64.77,62.23 IC3.2
N$15  (via drill 1.2)
  Audio 0.61: JIN.TIP arc90 -15.24,30.48 -15.24,-10.16 arc90 -7.62,-17.78 55.88,-17.78 arc90 78.74,2.54 78.74,60.33 arc90 72.39,61.59 v67.31,64.77
  Bottom 0.61: IC3.3 v67.31,64.77
PWRSLV  (via drill 1.1)
  OnBoardWire1 0.61: JPWR.GND -11.35,57.23 arc-90 -5.08,63.5 -2.54,63.5 arc-90 v3.81,64.77
  Bottom 0.61: D3.A 3.81,62.23 | 3.81,62.23 D4.C 3.81,52.07 13.97,52.07 C4.+ | 3.81,62.23 v3.81,64.77
PWRTIP  (via drill 1.1)
  OnBoardWire2 0.61: JPWR.PWR -5.35,55.52 arc90 -1.91,52.07 v1.27,52.07
  Bottom 0.61: D2.A 6.35,67.31 | 6.35,67.31 D1.C | C5.+ 1.27,39.37 v1.27,52.07 1.27,67.31 6.35,67.31

### Text on the board
Measures: 25 holes (vertical) | 32 holes (horizontal)
Reference: e | d | c | b | a | Z | Y | X | W | V | U | T | S | R | Q | P | O | N | M | L | K | J | I | H | G | F | E | D | C | B | A | 3 | 4 | 5 | 1 | 2 | 3 | 4 | 5 | 6 | 7 | 8 | 6 | 7 | 8 | 9 | 20 | 1 | 2 | 6 | 7 | 8 | 9 | 30 | 1 | 2 | 3 | 4 | 5 | 6 | 7 | 8 | 9 | 10 | 1 | 2 | 3 | 4 | 5